# EasyEDA Pro project _Mixer NEXT GEN V3_2026-02-06.epro, schematic mixer project v3

## Sheets
1 MIC1.Preamp: Board Name: PCB3.0; Create Date: 2025-10-28; Page Name: MIC1.Preamp; Project Name: Mixer NEXT GEN V3; Schematic Name: mixer project v3; Update Date: 2025-11-09; Company: EasyEDA.com; Drawed: M.Pogue; Page Size: A4; Part Number: JLCPCB-002; Reviewed: EasyEDA Pro; Version: V2.4
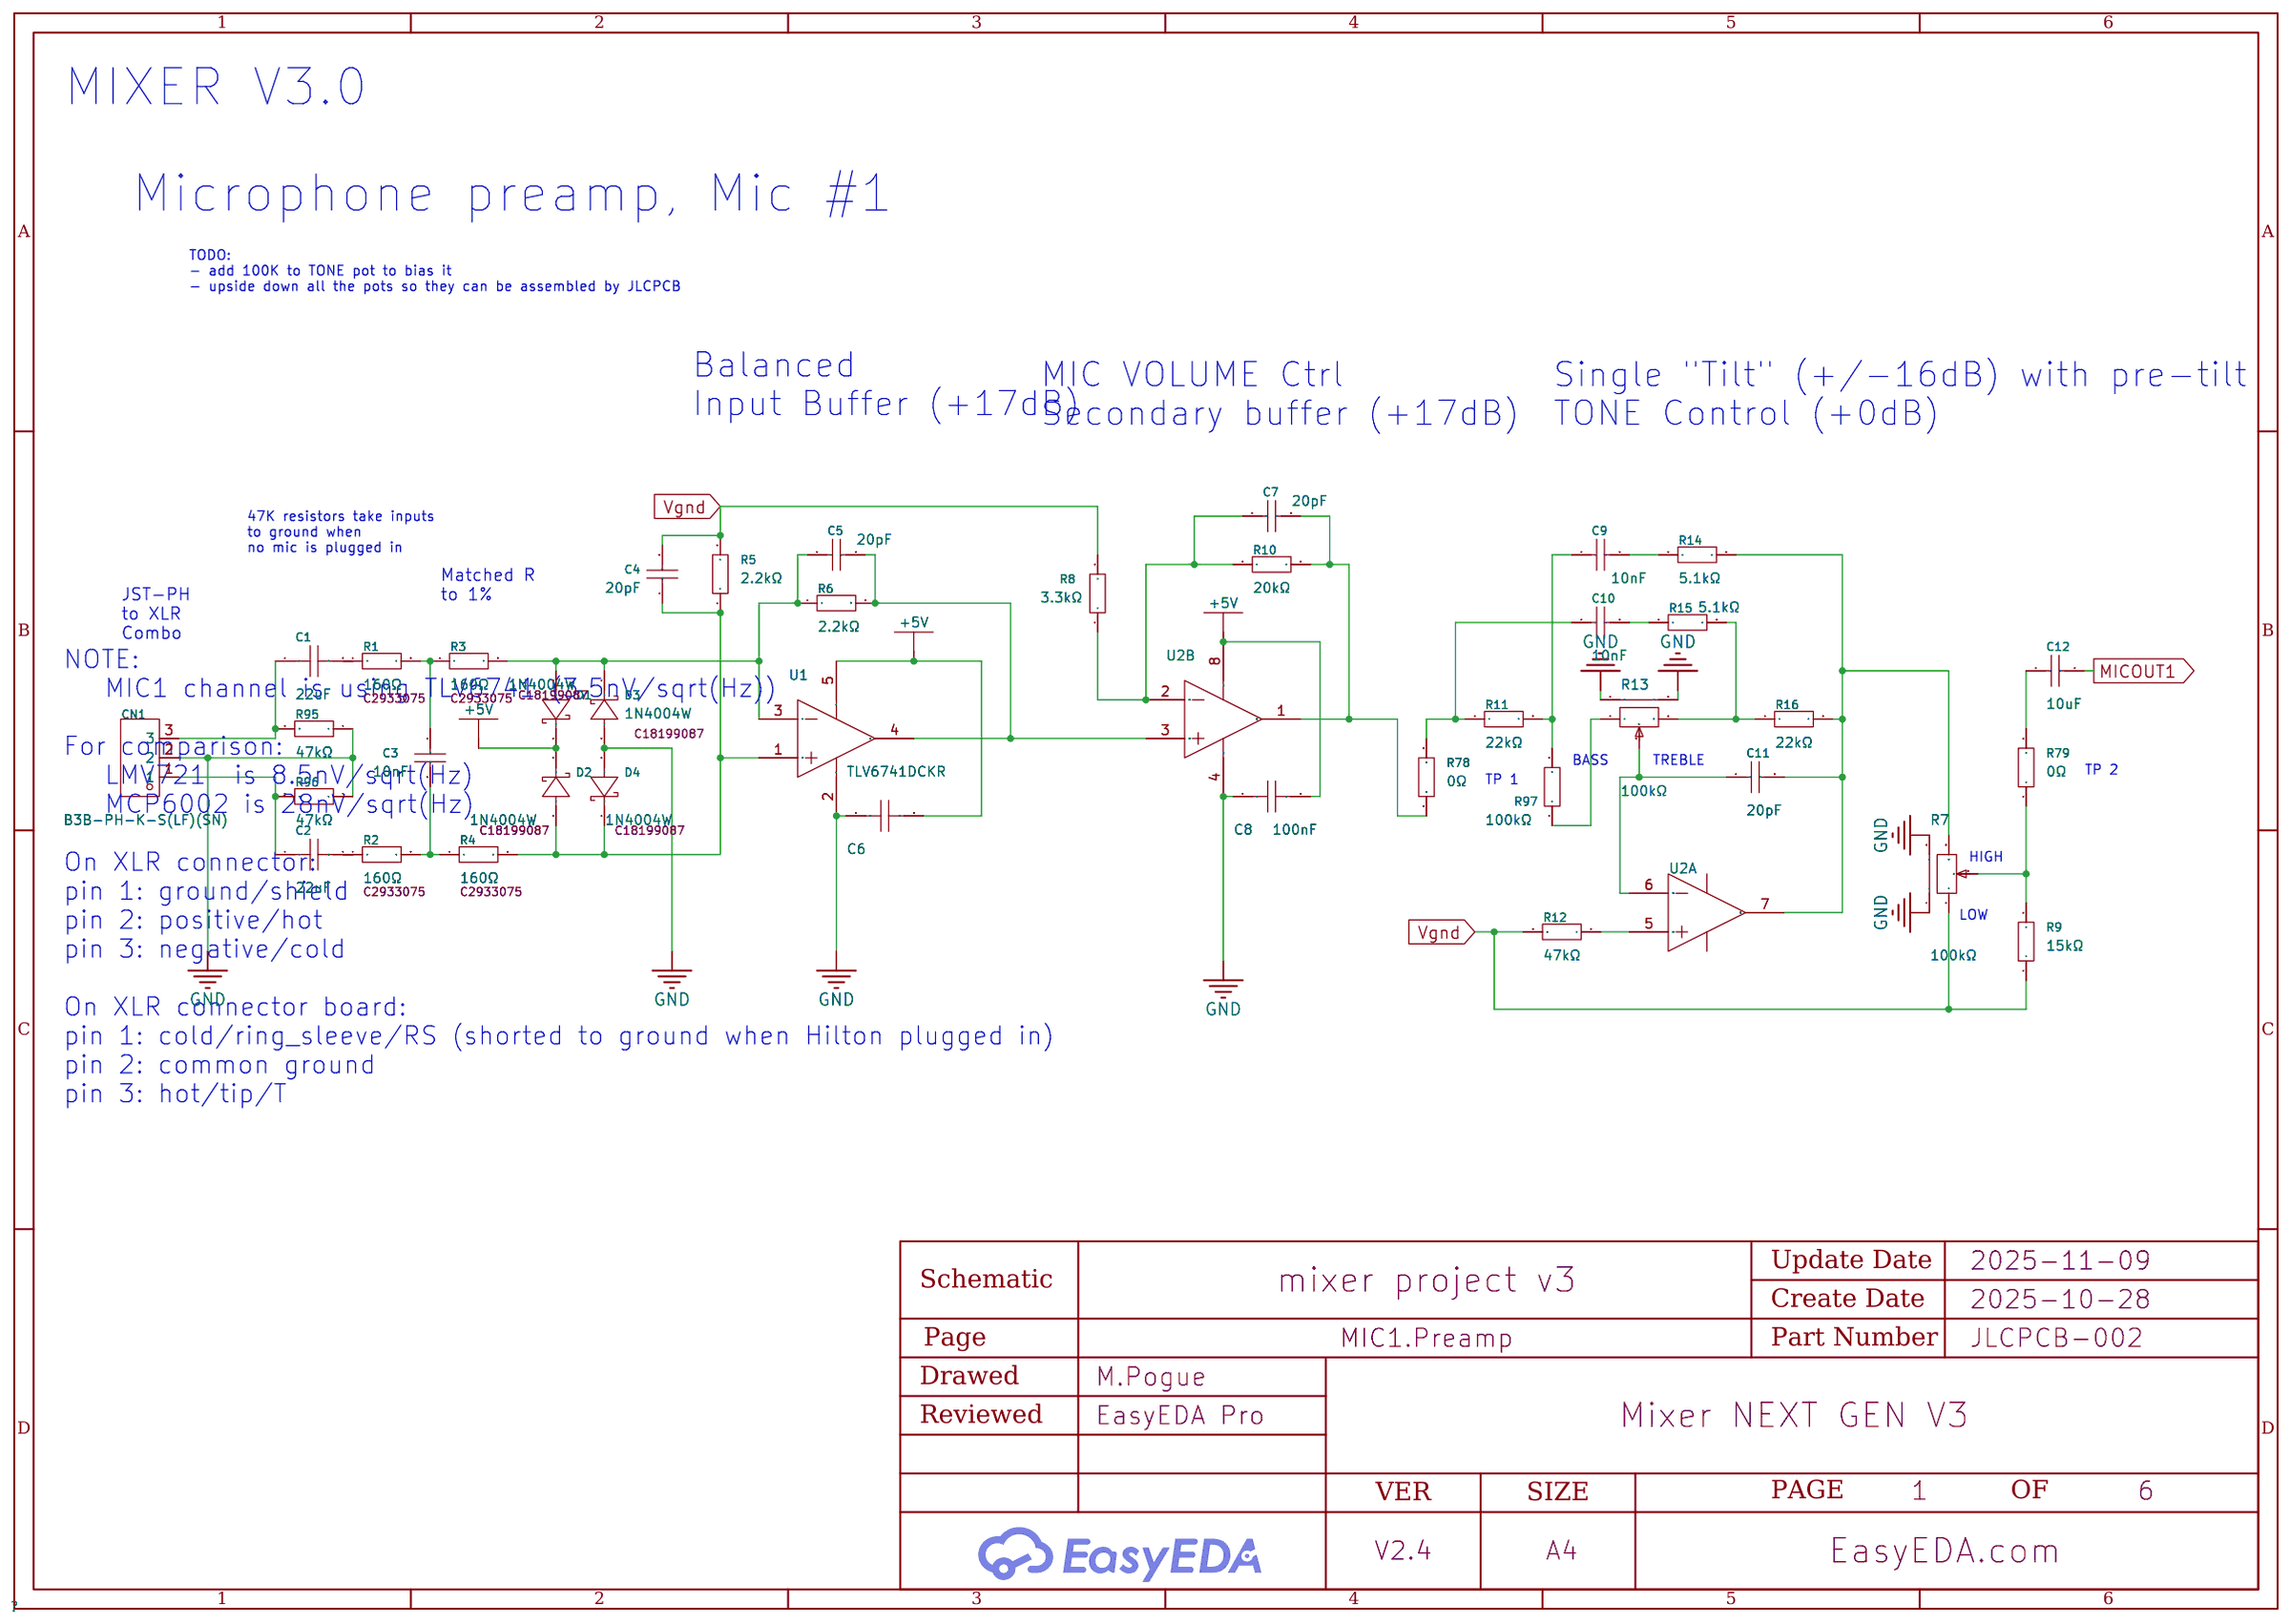
[diagram p0: MIC1.Preamp]
2 MIC2.Preamp: Page Name: MIC2.Preamp
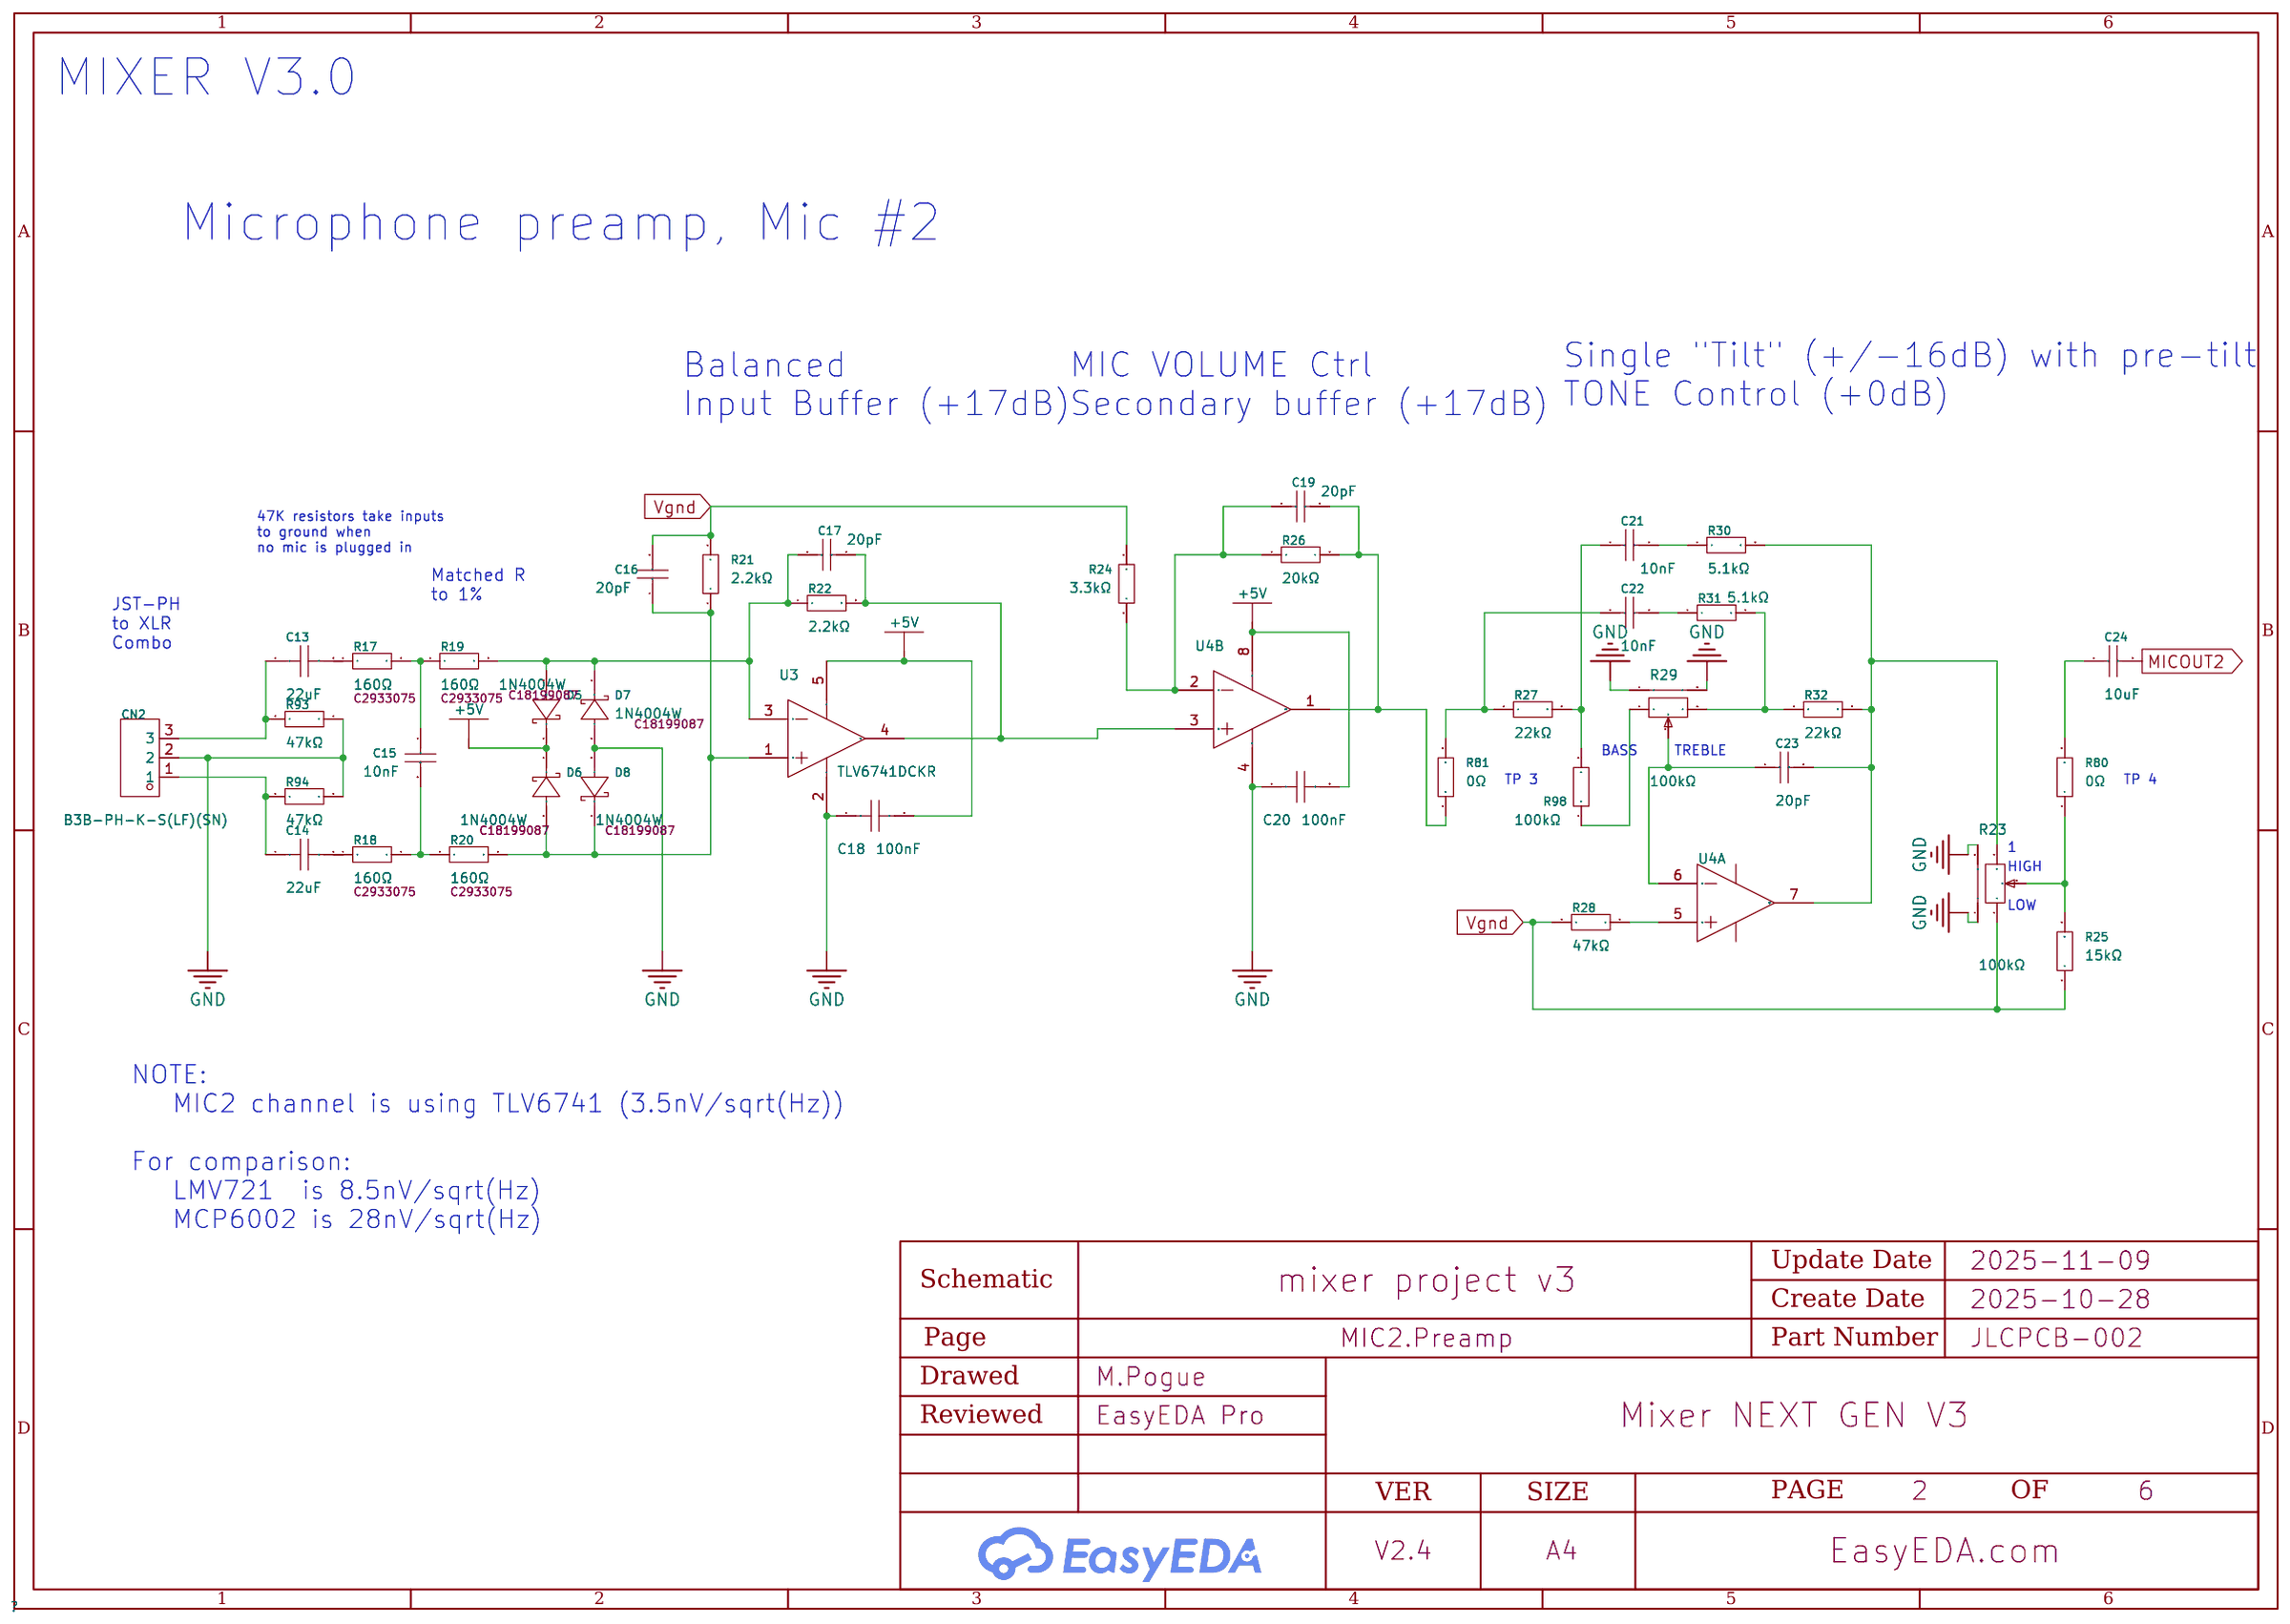
[diagram p1: MIC2.Preamp]
3 PowerSupply: Page Name: PowerSupply; Update Date: 2025-11-07
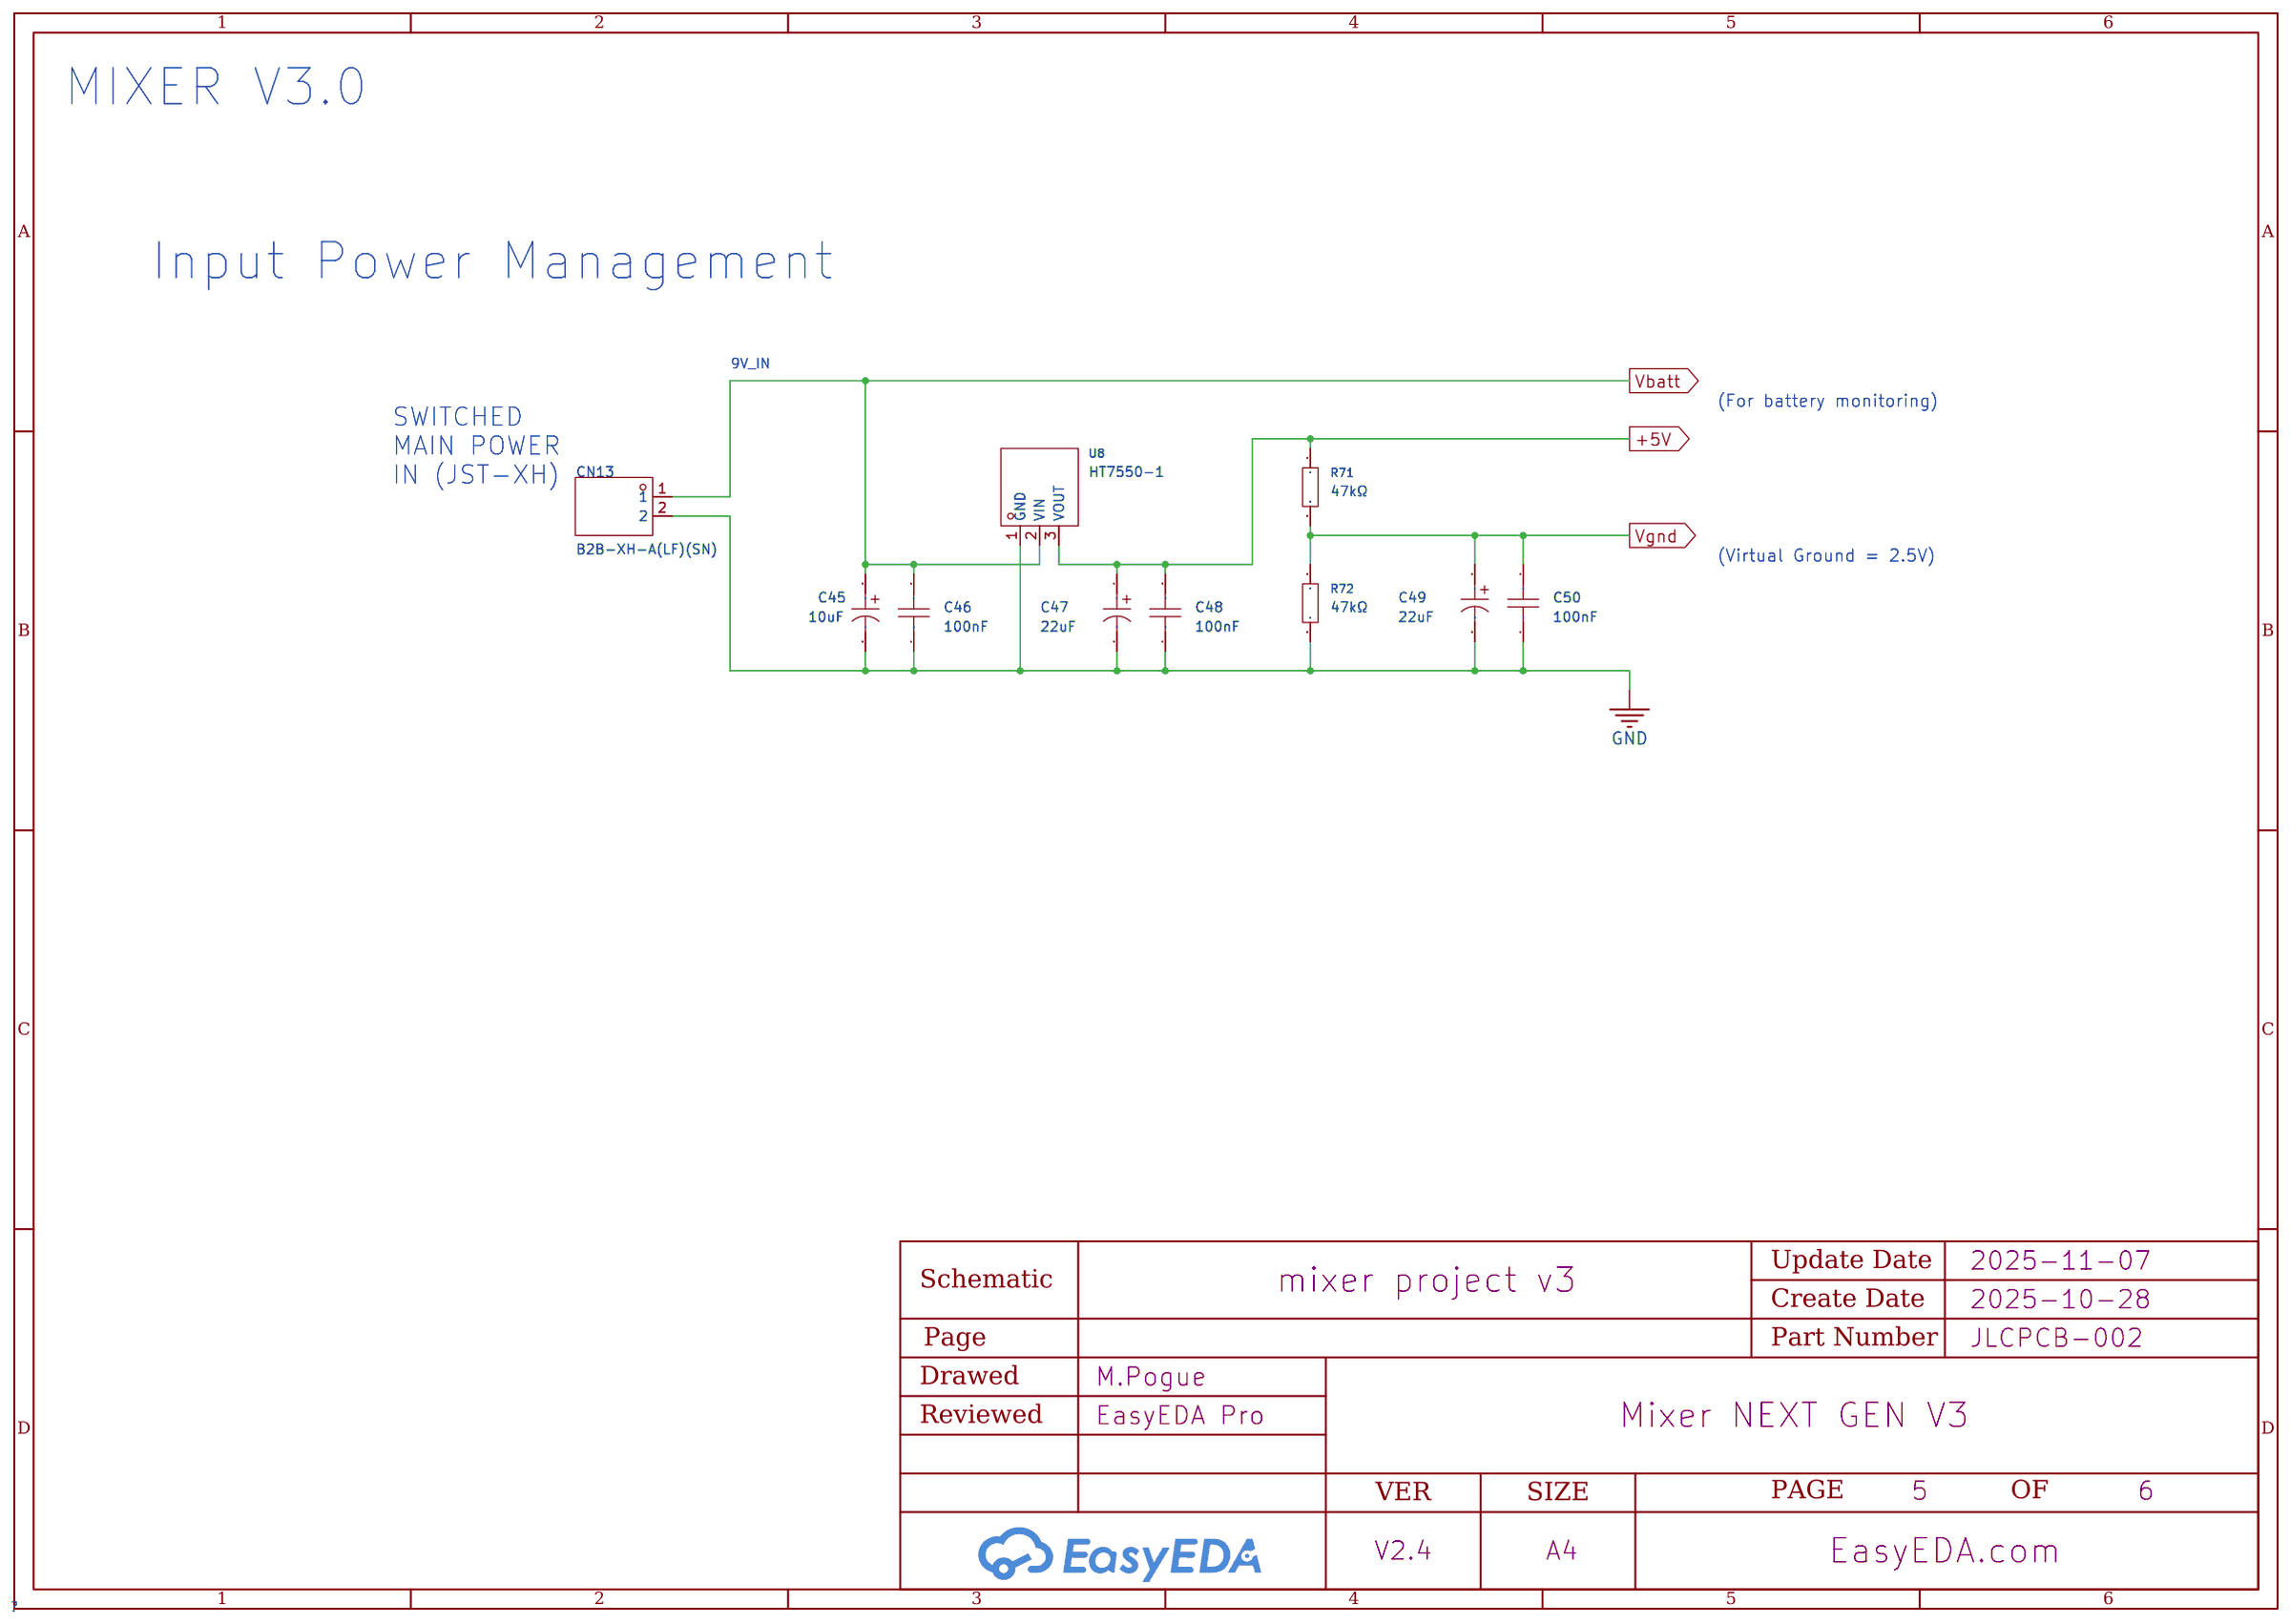
[diagram p2: PowerSupply]
4 MUSIC.Preamp: Page Name: MUSIC.Preamp; Update Date: 2025-11-20
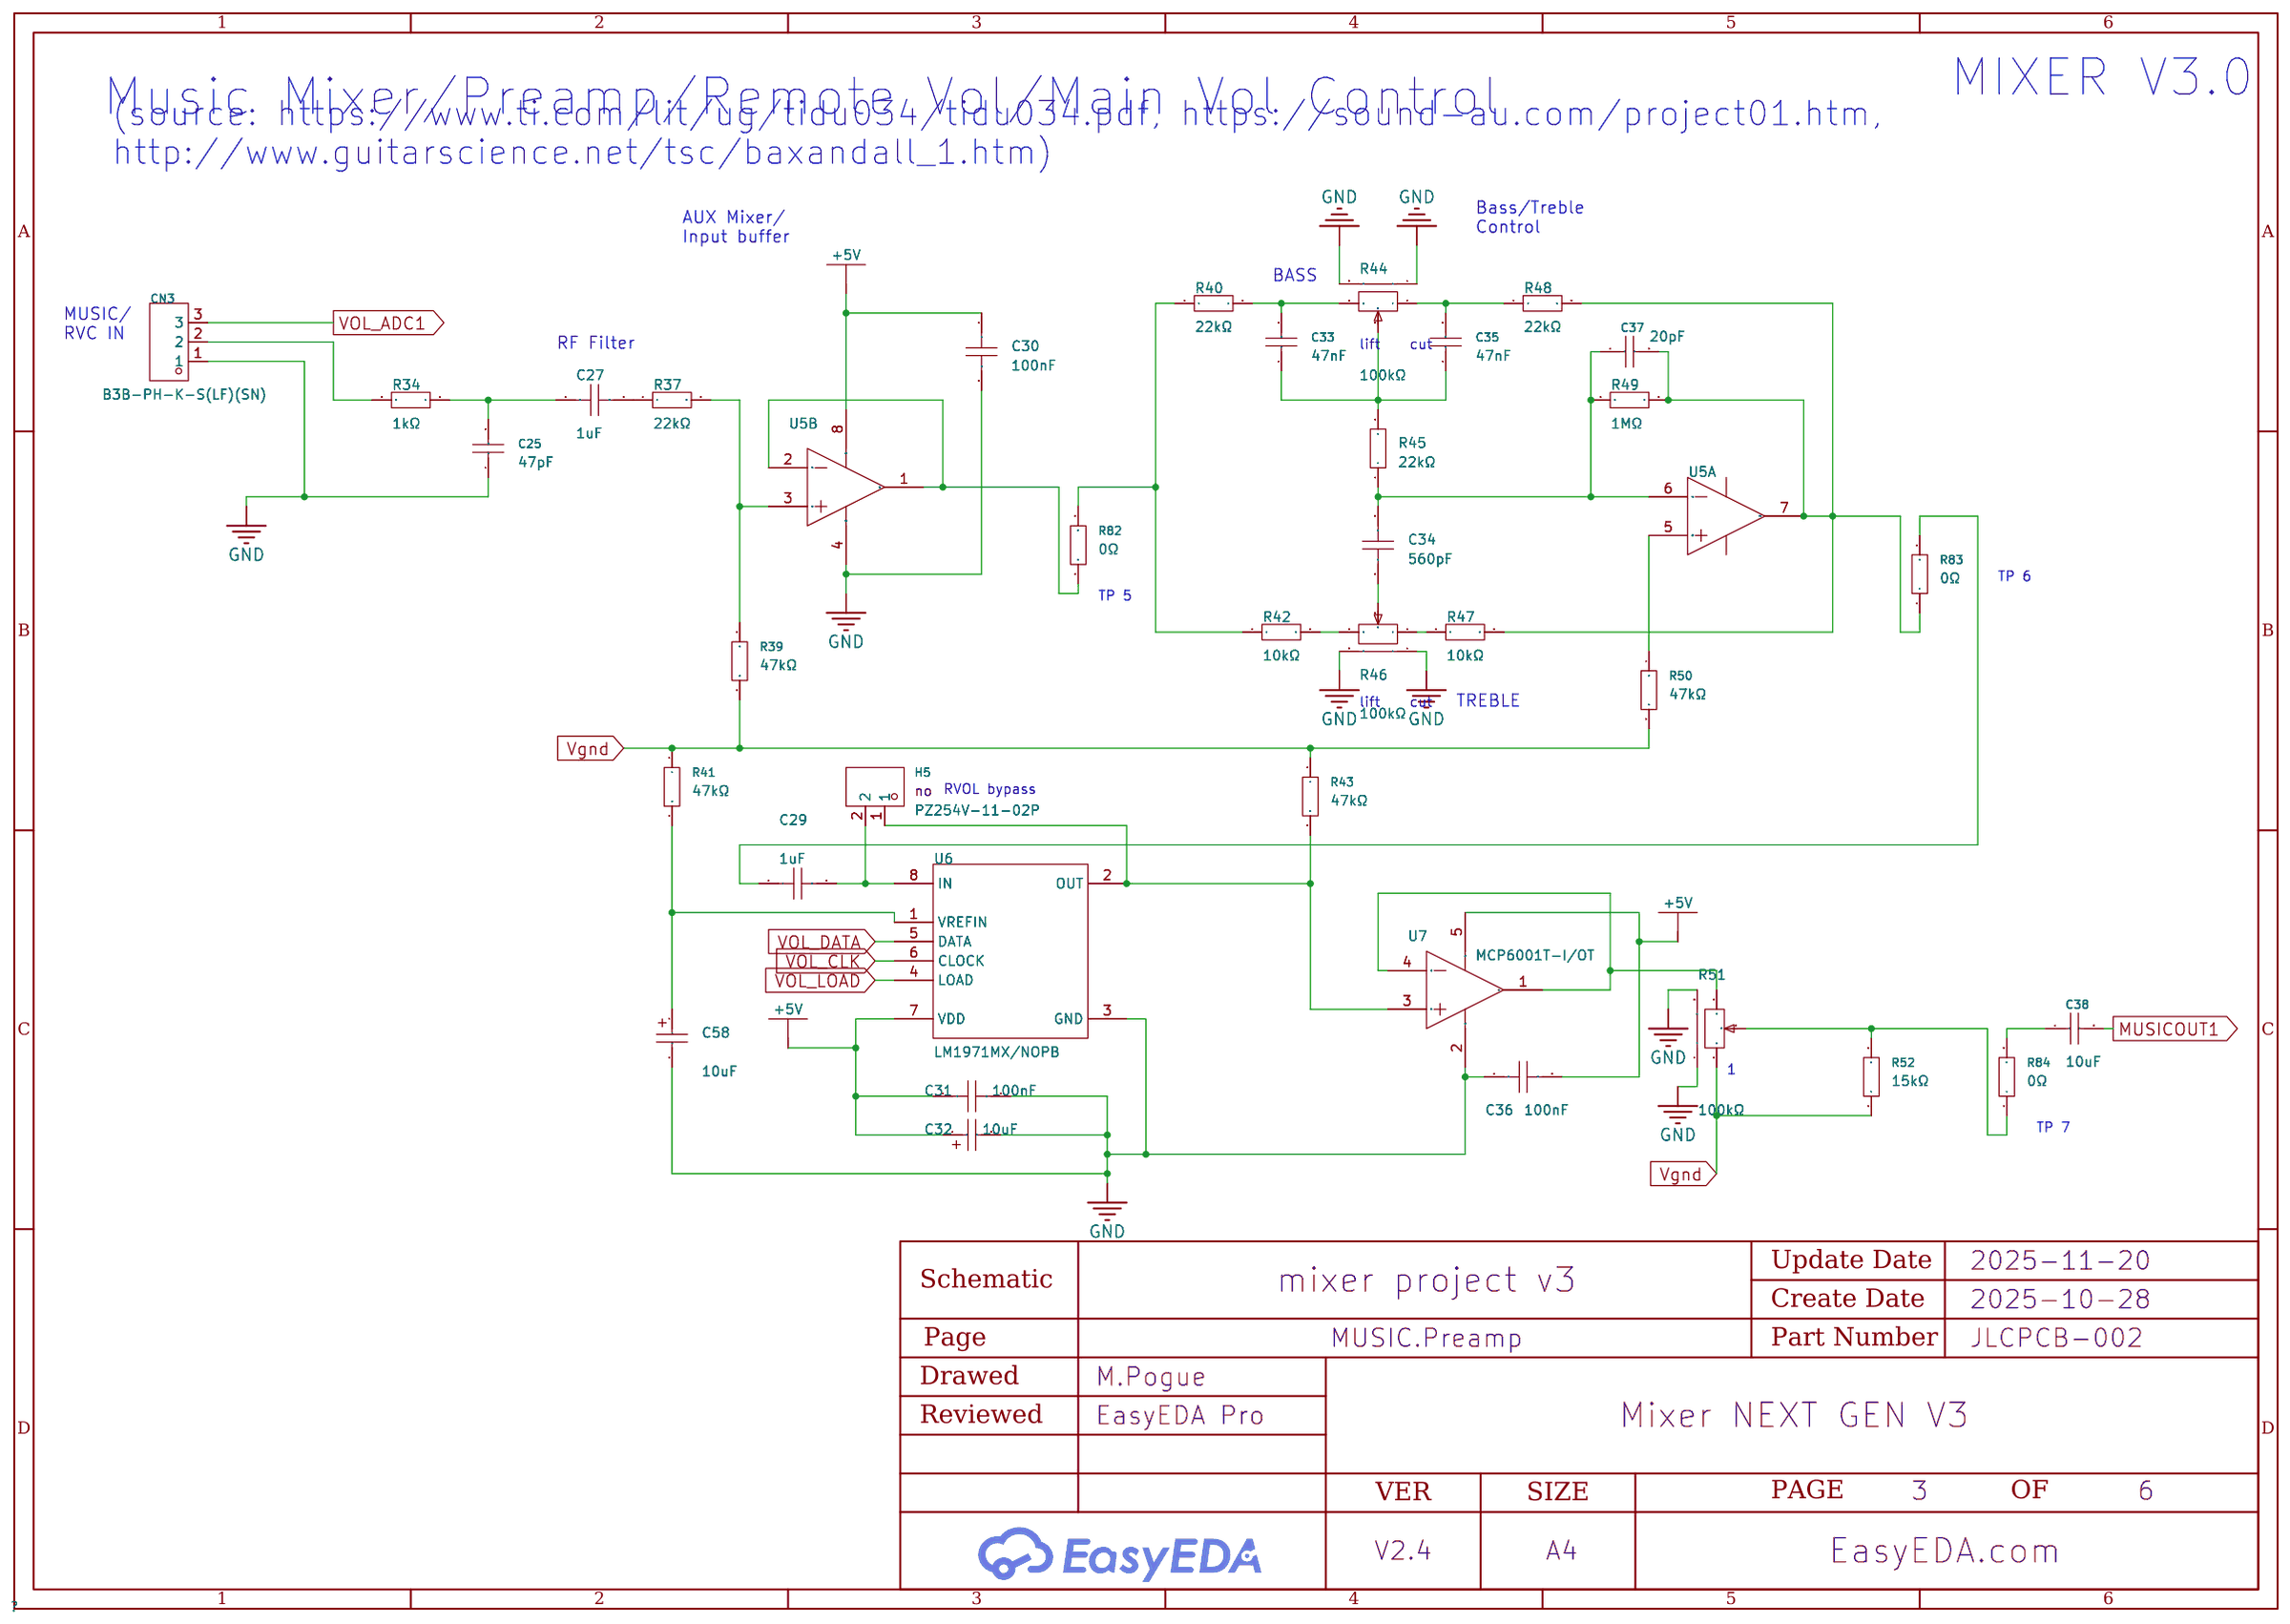
[diagram p3: MUSIC.Preamp]
5 OutputStage: Page Name: OutputStage; Update Date: 2025-10-28
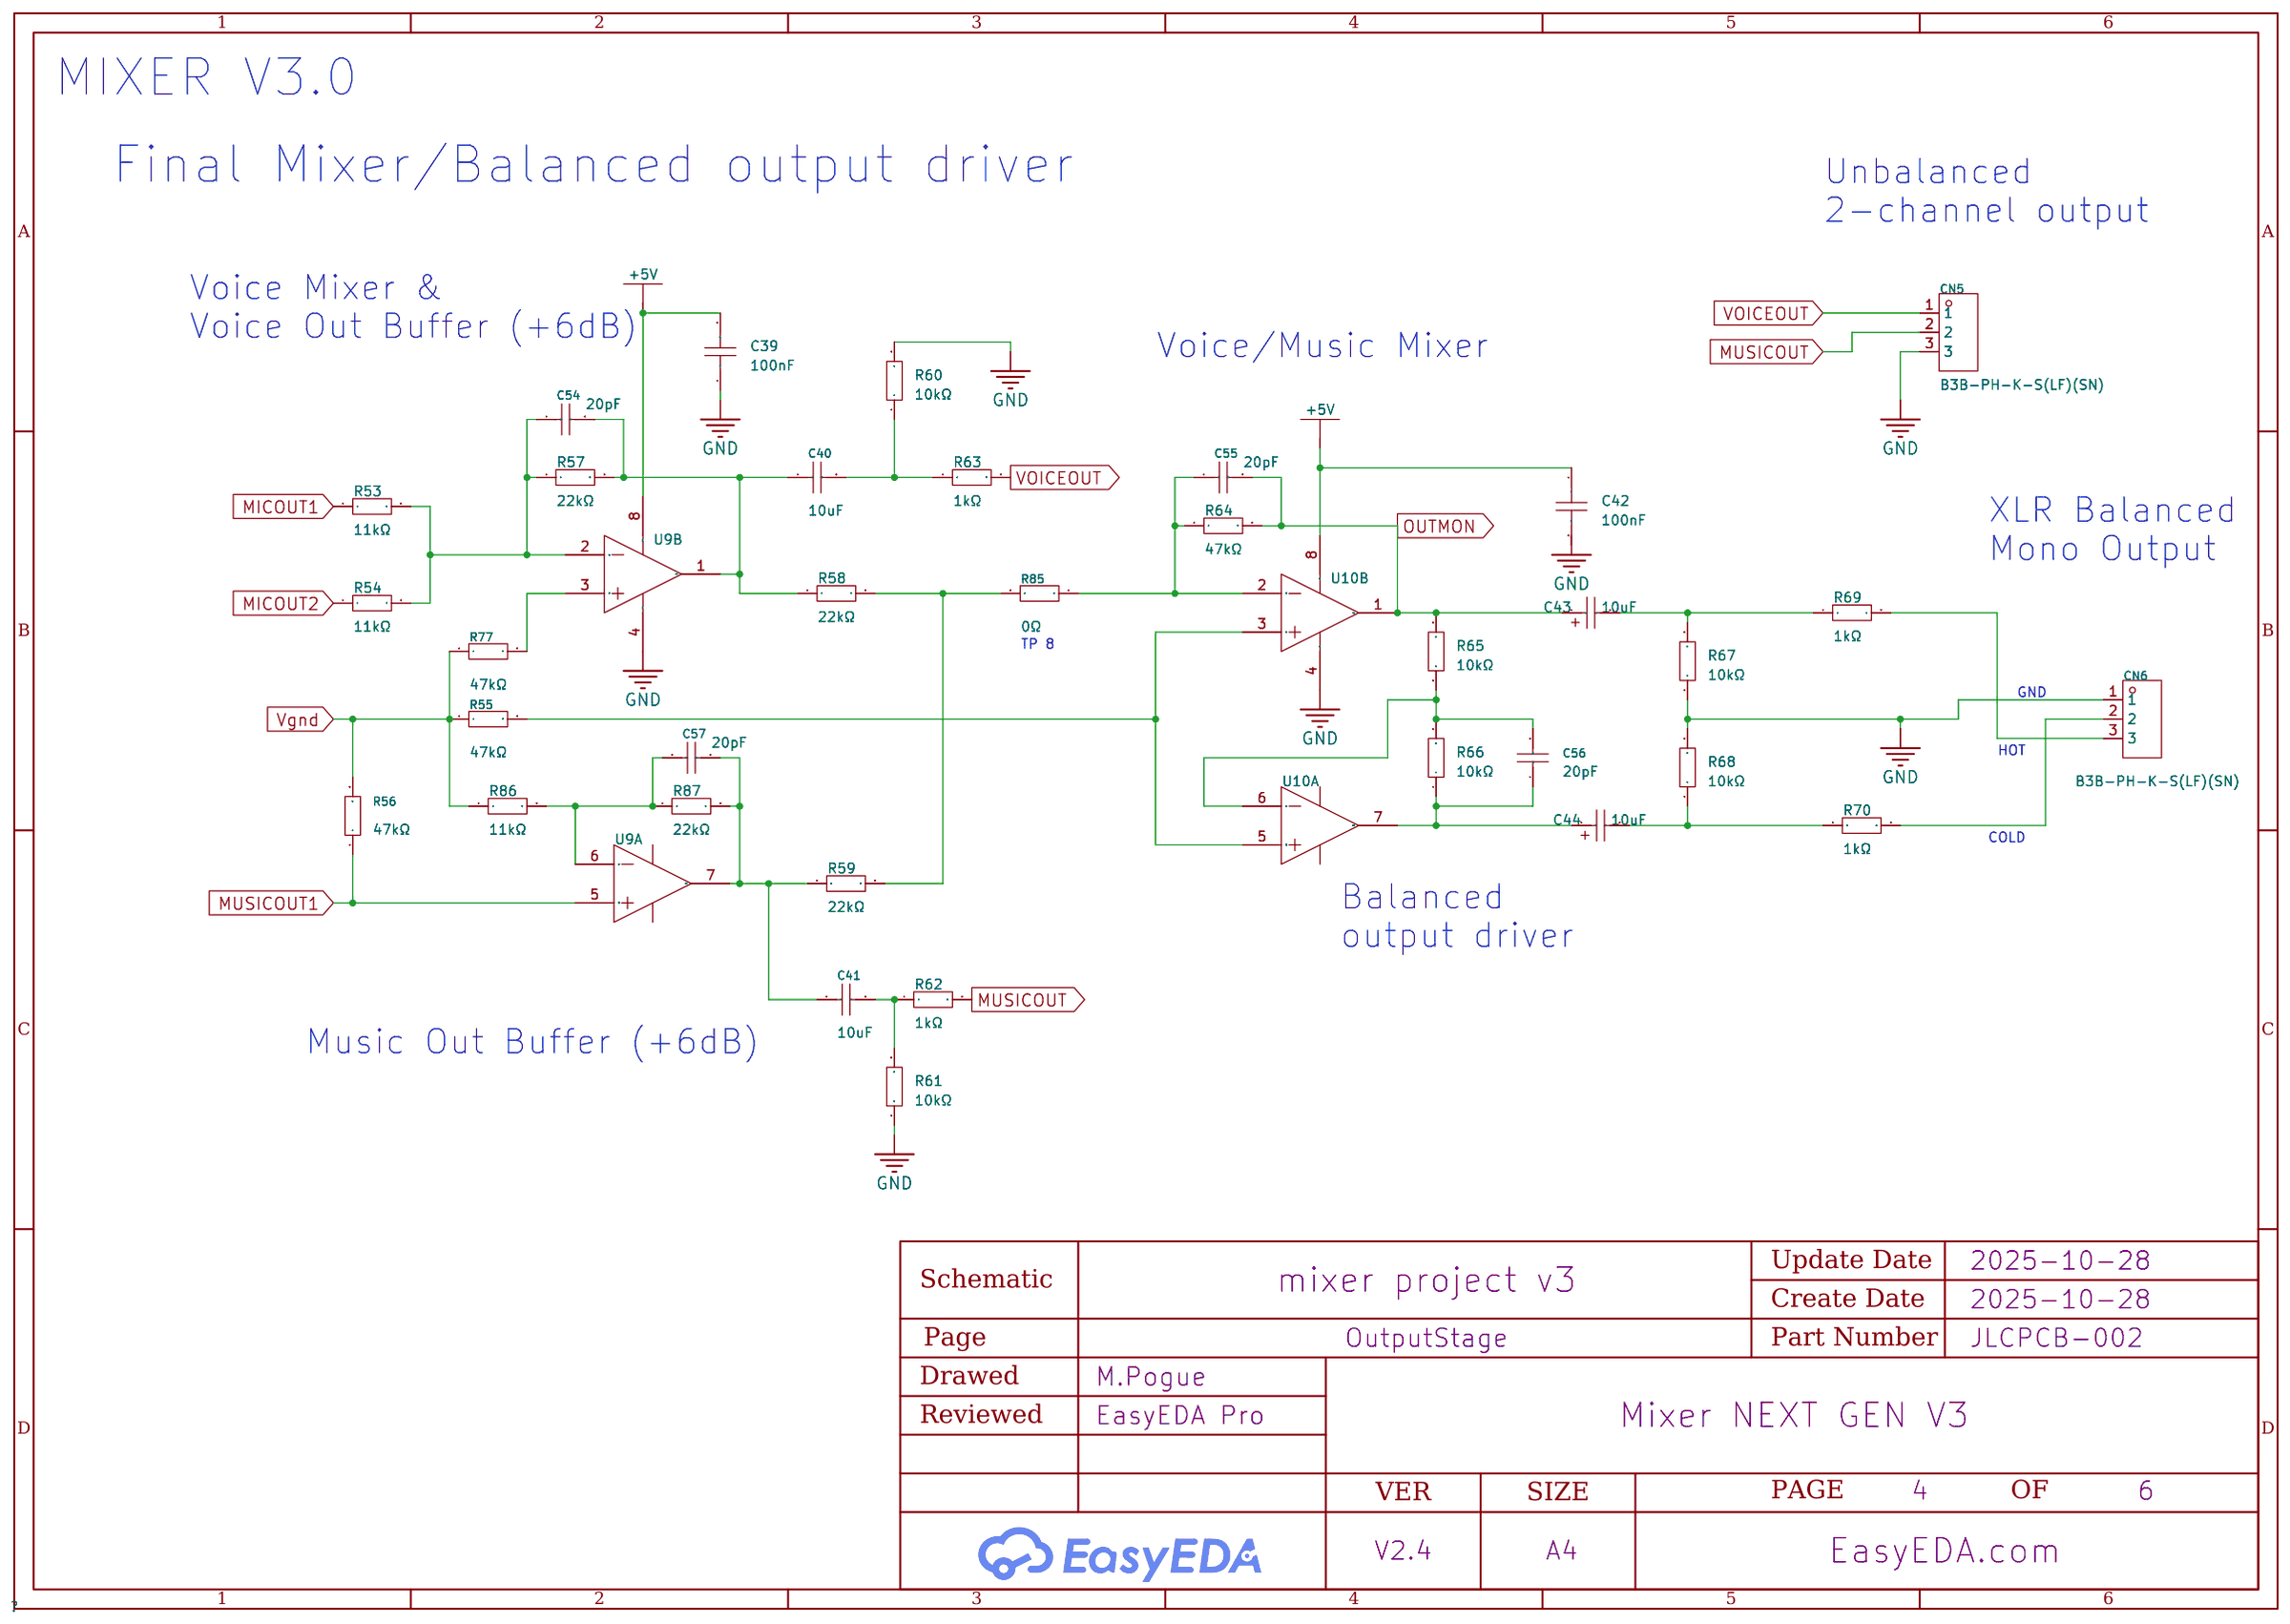
[diagram p4: OutputStage]
6 MCU: Page Name: MCU; Update Date: 2025-12-21; Company: zenstarstudio.com; Drawed: mpogue; Reviewed: mpogue; Version: V3.0.2
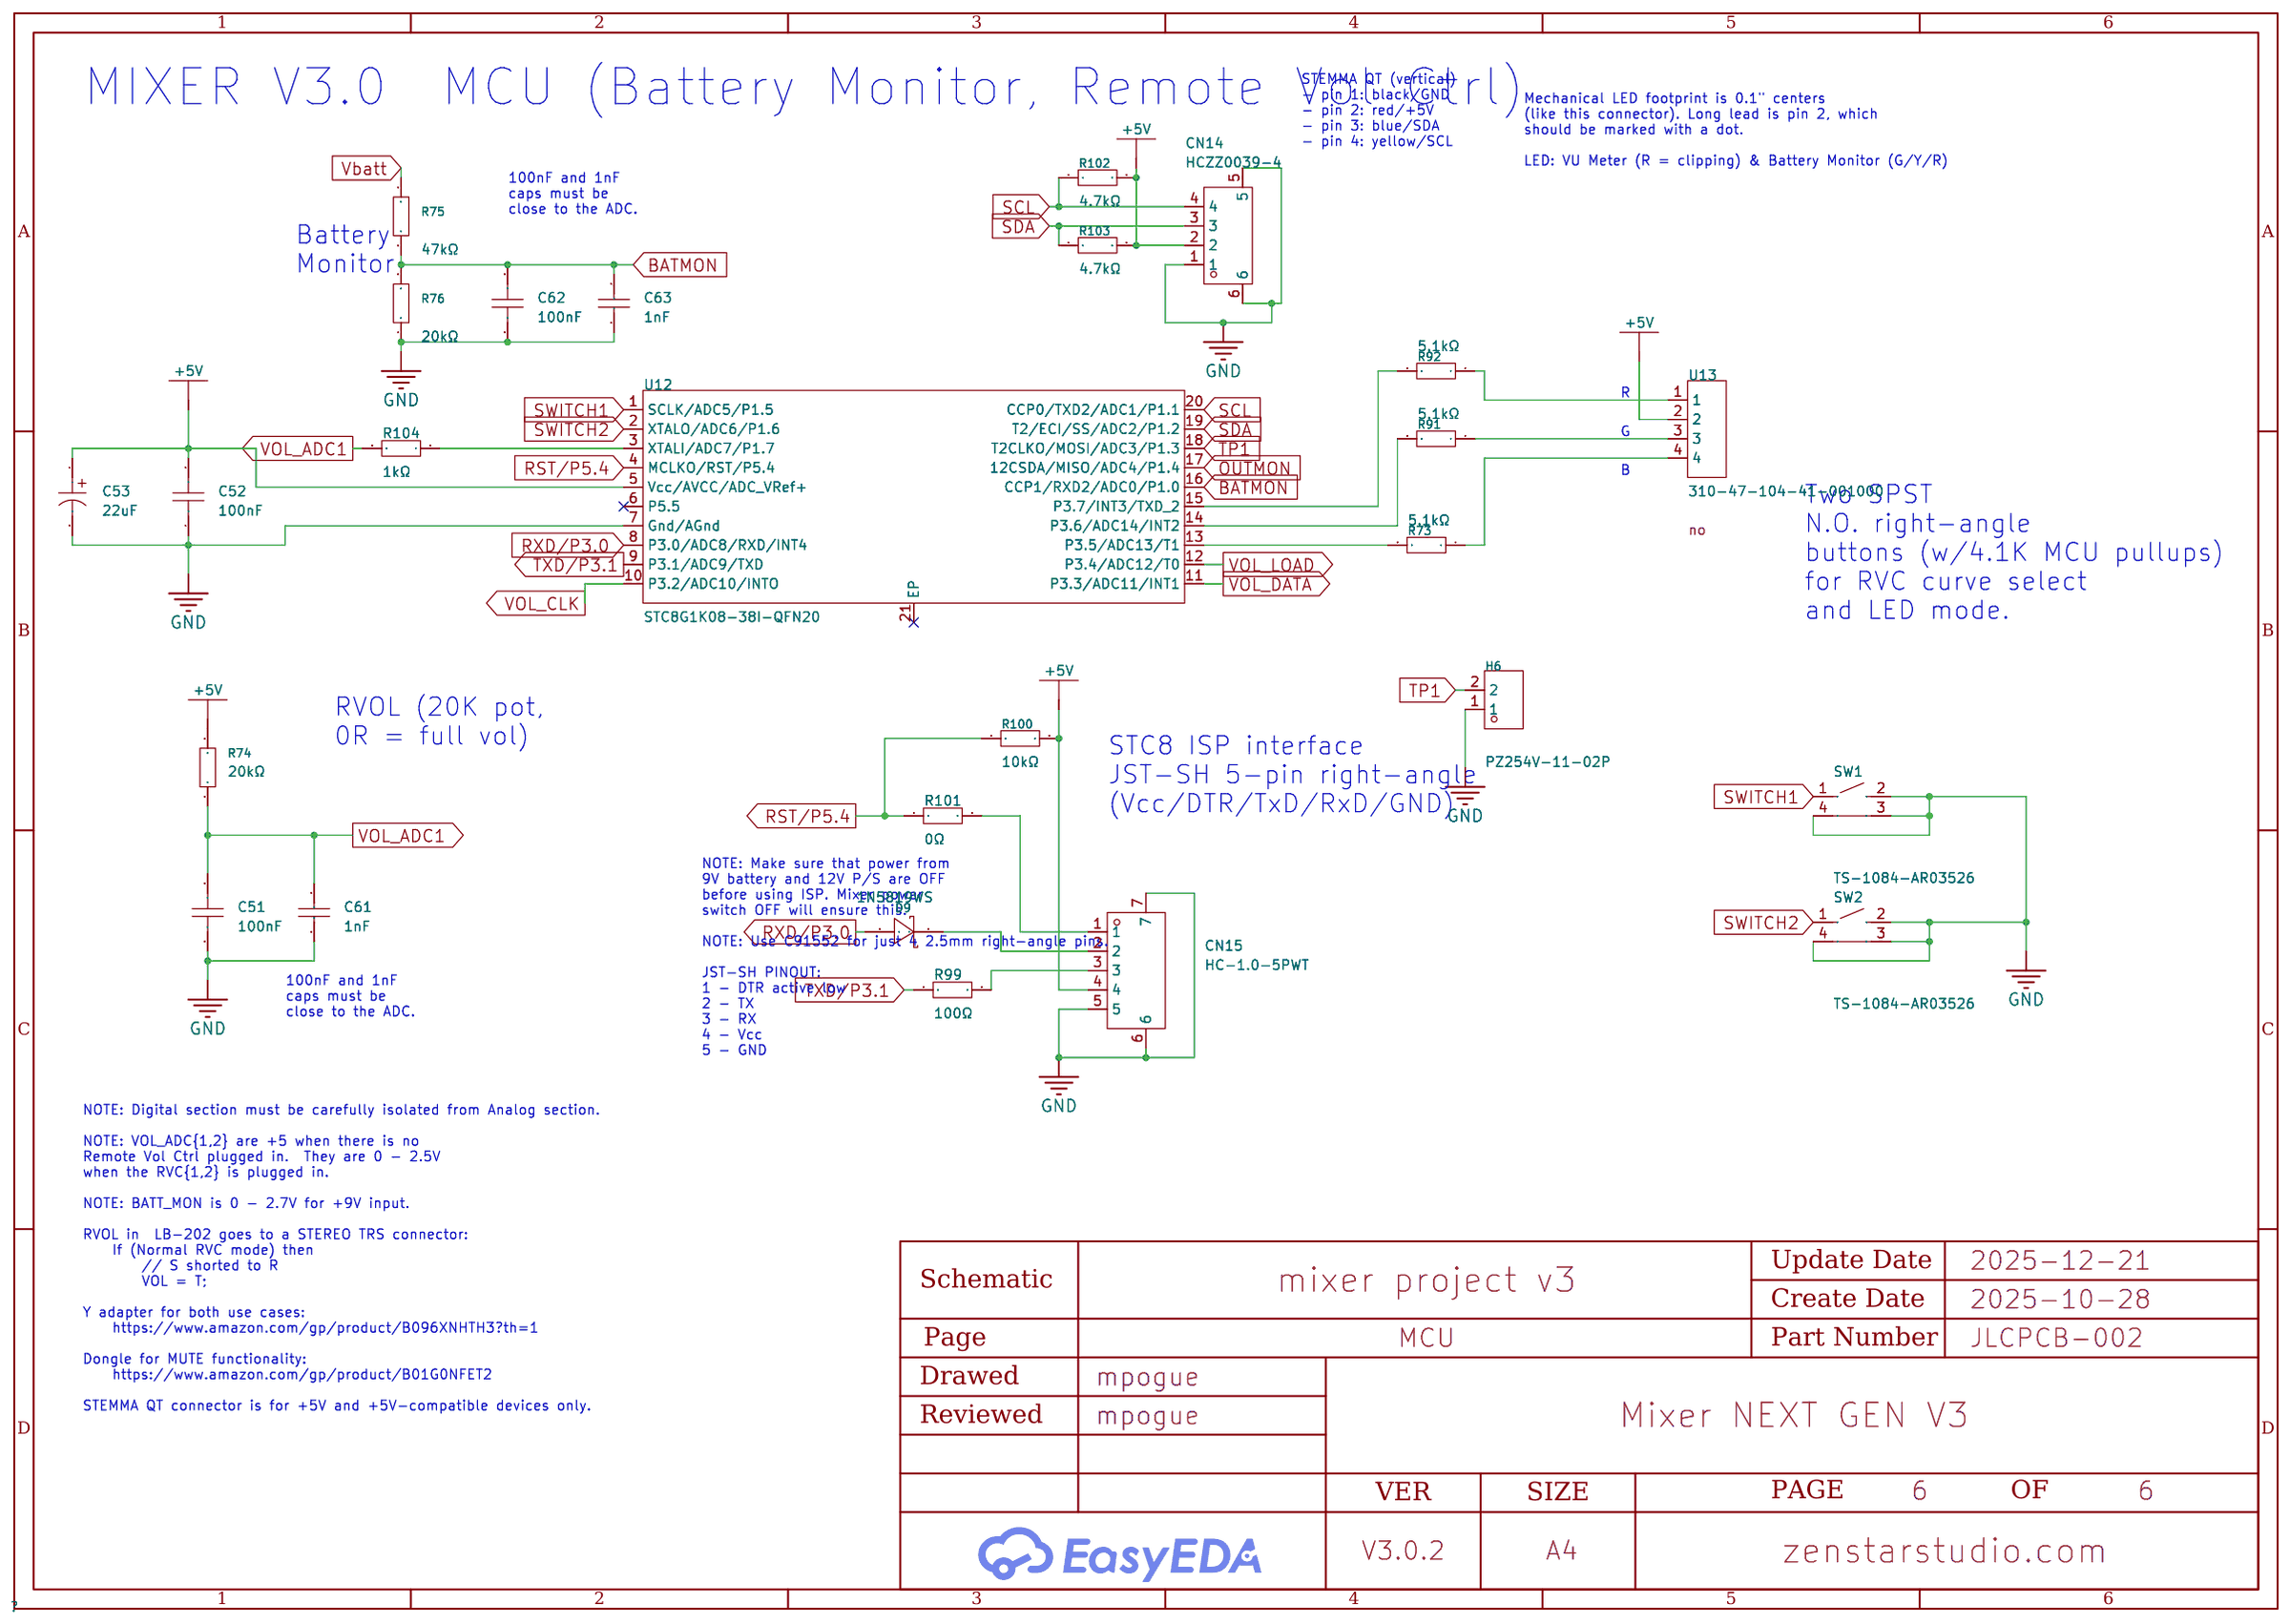
[diagram p5: MCU]

## Parts
sheet MCU
C51  100nF  [C0402]
C52  100nF  [C0402]
C53  22uF  [CAP-SMD_L3.2-W1.6]
C61  1nF  [C0402]
C62  100nF  [C0402]
C63  1nF  [C0402]
CN14  HCZZ0039-4  [CONN-SMD_HCZZ0039-4]
CN15  HC-1.0-5PWT  [CONN-SMD_5P-P1.00_HCTL_HC-1.0-5PWT]
D9  1N5819WS  [SOD-323_L1.8-W1.3-LS2.5-RD]
H6  PZ254V-11-02P  [HDR-TH_2P-P2.54-V-M]
R73  5.1kΩ  [R0402]
R74  20kΩ  [R0402]
R75  47kΩ  [R0402]
R76  20kΩ  [R0402]
R91  5.1kΩ  [R0402]
R92  5.1kΩ  [R0402]
R99  100Ω  [R0402]
R100  10kΩ  [R0402]
R101  0Ω  [R0603]
R102  4.7kΩ  [R0402]
R103  4.7kΩ  [R0402]
R104  1kΩ  [R0402]
SW1  TS-1084-AR03526  [SW-SMD_TS-1084-AR03526]
SW2  TS-1084-AR03526  [SW-SMD_TS-1084-AR03526]
U12  STC8G1K08-38I-QFN20  [TQFN-20L_L3.0-W3.0-P0.40-BL-EP]
U13  310-47-104-41-001000  [HDR-TH_4P-P2.54-V-F_316-XX-104-41-007000]  (no BOM)
sheet MIC1.Preamp
C1  22uF  [C0805]
C2  22uF  [C0805]
C3  10nF  [C0402]
C4  20pF  [C0402]
C5  20pF  [C0402]
C6  100nF  [C0402]
C7  20pF  [C0402]
C8  100nF  [C0402]
C9  10nF  [C0402]
C10  10nF  [C0402]
C11  20pF  [C0402]
C12  10uF  [C1206]
CN1  B3B-PH-K-S(LF)(SN)  [CONN-TH_B3B-PH-K-S]
D1  1N4004W  [SOD-123FL_L2.7-W1.8-LS3.8-RD]
D2  1N4004W  [SOD-123FL_L2.7-W1.8-LS3.8-RD]
D3  1N4004W  [SOD-123FL_L2.7-W1.8-LS3.8-RD]
D4  1N4004W  [SOD-123FL_L2.7-W1.8-LS3.8-RD]
R1  160Ω  [R0402]
R2  160Ω  [R0402]
R3  160Ω  [R0402]
R4  160Ω  [R0402]
R5  2.2kΩ  [R0402]
R6  2.2kΩ  [R0402]
R7  100kΩ  [RES-ADJ-TH_RK09K1130AJ3]  (no BOM)
R8  3.3kΩ  [R0402]
R9  15kΩ  [R0402]
R10  20kΩ  [R0402]
R11  22kΩ  [R0402]
R12  47kΩ  [R0402]
R13  100kΩ  [RES-ADJ-TH_RK09K1130AJ3]  (no BOM)
R14  5.1kΩ  [R0402]
R15  5.1kΩ  [R0402]
R16  22kΩ  [R0402]
R78  0Ω  [R0805]
R79  0Ω  [R0805]
R95  47kΩ  [R0402]
R96  47kΩ  [R0402]
R97  100kΩ  [R0402]
U1  TLV6741DCKR  [SC-70-5_L2.0-W1.3-P0.65-LS2.1-BR]
U2  MCP6002-I/SN  [SOIC-8_L4.9-W3.9-P1.27-LS6.0-BL]  (sections 1,2)
sheet MIC2.Preamp
C13  22uF  [C0805]
C14  22uF  [C0805]
C15  10nF  [C0402]
C16  20pF  [C0402]
C17  20pF  [C0402]
C18  100nF  [C0402]
C19  20pF  [C0402]
C20  100nF  [C0402]
C21  10nF  [C0402]
C22  10nF  [C0402]
C23  20pF  [C0402]
C24  10uF  [C1206]
CN2  B3B-PH-K-S(LF)(SN)  [CONN-TH_B3B-PH-K-S]
D5  1N4004W  [SOD-123FL_L2.7-W1.8-LS3.8-RD]
D6  1N4004W  [SOD-123FL_L2.7-W1.8-LS3.8-RD]
D7  1N4004W  [SOD-123FL_L2.7-W1.8-LS3.8-RD]
D8  1N4004W  [SOD-123FL_L2.7-W1.8-LS3.8-RD]
R17  160Ω  [R0402]
R18  160Ω  [R0402]
R19  160Ω  [R0402]
R20  160Ω  [R0402]
R21  2.2kΩ  [R0402]
R22  2.2kΩ  [R0402]
R23  100kΩ  [RES-ADJ-TH_RK09K1130AJ3]  (no BOM)
R24  3.3kΩ  [R0402]
R25  15kΩ  [R0402]
R26  20kΩ  [R0402]
R27  22kΩ  [R0402]
R28  47kΩ  [R0402]
R29  100kΩ  [RES-ADJ-TH_RK09K1130AJ3]  (no BOM)
R30  5.1kΩ  [R0402]
R31  5.1kΩ  [R0402]
R32  22kΩ  [R0402]
R80  0Ω  [R0805]
R81  0Ω  [R0805]
R93  47kΩ  [R0402]
R94  47kΩ  [R0402]
R98  100kΩ  [R0402]
U3  TLV6741DCKR  [SC-70-5_L2.0-W1.3-P0.65-LS2.1-BR]
U4  MCP6002-I/SN  [SOIC-8_L4.9-W3.9-P1.27-LS6.0-BL]  (sections 1,2)
sheet MUSIC.Preamp
C25  47pF  [C0402]
C27  1uF  [C0402]
C29  1uF  [C0402]
C30  100nF  [C0402]
C31  100nF  [C0402]
C32  10uF  [CAP-SMD_L3.2-W1.6-RD-C7171]
C33  47nF  [C0603]
C34  560pF  [C0402]
C35  47nF  [C0603]
C36  100nF  [C0402]
C37  20pF  [C0402]
C38  10uF  [C1206]
C58  10uF  [CAP-SMD_L3.2-W1.6-RD-C7171]
CN3  B3B-PH-K-S(LF)(SN)  [CONN-TH_B3B-PH-K-S]
H5  PZ254V-11-02P  [HDR-TH_2P-P2.54-V-M]  (no BOM)
R34  1kΩ  [R0402]
R37  22kΩ  [R0402]
R39  47kΩ  [R0402]
R40  22kΩ  [R0402]
R41  47kΩ  [R0402]
R42  10kΩ  [R0402]
R43  47kΩ  [R0402]
R44  100kΩ  [RES-ADJ-TH_RK09K1130AJ3]  (no BOM)
R45  22kΩ  [R0402]
R46  100kΩ  [RES-ADJ-TH_RK09K1130AJ3]  (no BOM)
R47  10kΩ  [R0402]
R48  22kΩ  [R0402]
R49  1MΩ  [R0402]
R50  47kΩ  [R0402]
R51  100kΩ  [RES-ADJ-TH_RK09K1130AJ3]  (no BOM)
R52  15kΩ  [R0402]
R82  0Ω  [R0805]
R83  0Ω  [R0805]
R84  0Ω  [R0805]
U5  MCP6002-I/SN  [SOIC-8_L4.9-W3.9-P1.27-LS6.0-BL]  (sections 1,2)
U6  LM1971MX/NOPB  [SOIC-8_L4.9-W3.9-P1.27-LS6.0-BL]
U7  MCP6001T-I/OT  [SOT-23-5_L3.0-W1.7-P0.95-LS2.8-BR]
sheet OutputStage
C39  100nF  [C0402]
C40  10uF  [C1206]
C41  10uF  [C1206]
C42  100nF  [C0402]
C43  10uF  [CAP-SMD_L3.2-W1.6-RD-C7171]
C44  10uF  [CAP-SMD_L3.2-W1.6-RD-C7171]
C54  20pF  [C0402]
C55  20pF  [C0402]
C56  20pF  [C0402]
C57  20pF  [C0402]
CN5  B3B-PH-K-S(LF)(SN)  [CONN-TH_B3B-PH-K-S]
CN6  B3B-PH-K-S(LF)(SN)  [CONN-TH_B3B-PH-K-S]
R53  11kΩ  [R0805]
R54  11kΩ  [R0805]
R55  47kΩ  [R0402]
R56  47kΩ  [R0402]
R57  22kΩ  [R0402]
R58  22kΩ  [R0402]
R59  22kΩ  [R0402]
R60  10kΩ  [R0402]
R61  10kΩ  [R0402]
R62  1kΩ  [R0402]
R63  1kΩ  [R0402]
R64  47kΩ  [R0805]
R65  10kΩ  [R0402]
R66  10kΩ  [R0402]
R67  10kΩ  [R0402]
R68  10kΩ  [R0402]
R69  1kΩ  [R0402]
R70  1kΩ  [R0402]
R77  47kΩ  [R0402]
R85  0Ω  [R0805]
R86  11kΩ  [R0805]
R87  22kΩ  [R0402]
U9  MCP6002-I/SN  [SOIC-8_L4.9-W3.9-P1.27-LS6.0-BL]  (sections 1,2)
U10  MCP6002-I/SN  [SOIC-8_L4.9-W3.9-P1.27-LS6.0-BL]  (sections 1,2)
sheet PowerSupply
C45  10uF  [CASE-B_3528]
C46  100nF  [C0402]
C47  22uF  [CAP-SMD_L3.2-W1.6]
C48  100nF  [C0402]
C49  22uF  [CAP-SMD_L3.2-W1.6]
C50  100nF  [C0402]
CN13  B2B-XH-A(LF)(SN)  [CONN-TH_B2B-XH-A-LF-SN]
R71  47kΩ  [R0402]
R72  47kΩ  [R0402]
U8  HT7550-1  [SOT-89_L4.5-W2.5-P1.50-LS4.2-BR]

## Library data of the parts
C6 C8 C18 C20 C30 C31 C36 C39 C42 C48 C50-C52 C62 = CL05B104KO5NNNC: Capacitance: Tolerance:±10% Tolerance:±10% Voltage Rated: Temperature Coefficient:; LCSC Part Name: 100nF ±10% 16V; Supplier Part: C1525; Manufacturer: SAMSUNG(三星); Supplier Footprint: 0402; JLCPCB Part Class: Basic Part; Datasheet: https://atta.szlcsc.com/upload/public/pdf/source/20160218/1457707763339.pdf; Supplier: LCSC; Tolerance: ±10%; Check: true
C47 C49 C53 = CA45-A-16V-22uF-K: Capacitance: Tolerance:±10% Tolerance:±10% Rated Voltage: Equivalent Series Resistance(ESR):6Ω@100kHz Operating Temperature:-55℃~+125℃ Operating Temperature:-55℃~+125℃; LCSC Part Name: 22uF ±10% 16V; Supplier Part: C782264; Manufacturer: CEC(振华新云); Supplier Footprint: CASE-A-3216; JLCPCB Part Class: Extended Part; Datasheet: https://atta.szlcsc.com/upload/public/pdf/source/20200909/C782264_D6D9C4EF3B25E81633C26A9294FBB820.pdf; Supplier: LCSC; Tolerance: ±10%; Equivalent Series Resistance(ESR): 6Ω@100kHz; Operating Temperature: -55℃~+125℃
C61 C63 = 0402B102K500NT: Capacitance:1nF Tolerance:±10% Tolerance:±10% Voltage Rating:50V Temperature Coefficient:X7R; LCSC Part Name: 1nF ±10% 50V; Supplier Part: C1523; Manufacturer: FH(风华); Supplier Footprint: 0402; JLCPCB Part Class: Basic Part; Datasheet: https://item.szlcsc.com/datasheet/0402B102K500NT/1875.html; Supplier: LCSC; Tolerance: ±10%; Voltage Rating: 50V; Temperature Coefficient: X7R
CN14 = HCZZ0039-4: Pins Structure:1x4P Pitch:1mm Mounting Type:Standing paste Reference Series:SH Number of Pins:4P Number of Rows:1 Number of PINs Per Row:4 Row Spacing:- Current Rating:1A Contact Material:Copper Contact Plating:Tin Operating Temperature:-25℃~+85℃ Operatin; LCSC Part Name: 米色 1x4P 间距:1mm 立贴 系列:SH; Supplier Part: C7433440; Manufacturer: HC(虹成电子); Supplier Footprint: SMD,P=1mm; JLCPCB Part Class: Extended Part; Datasheet: https://atta.szlcsc.com/upload/public/pdf/source/20250106/4055322CB7D3ABC14DCC80A80116D5CE.pdf; Supplier: LCSC; Pins Structure: 1x4P; Pitch: 1mm; Mounting Type: Standing paste; Reference Series: SH; Number of Pins: 4P; Number of Rows: 1; Number of PINs Per Row: 4; Current Rating: 1A; Contact Material: Copper; Contact Plating: Tin; Operating Temperature: -25℃~+85℃; Voltage Rating: 50V; Plastic Material: LCP; Color: Beige; X-Length of Bottom Edge on Board (Spacing Line): 6.3mm; Y-Width of Bottom Edge on Board: 3.76mm
CN15 = HC-1.0-5PWT: Pins Structure:1x5P Pitch:1mm Mounting Type:Surface Mount, Right Angle Reference Series:SH Number of Pins:5P Number of Rows:1 Number of PINs Per Row:5 Row Spacing:- Current Rating:1A Contact Material:Phosphor Bronze Contact Plating:Tin Operating Temperatu; LCSC Part Name: 1x5P 间距:1mm 卧贴 系列:SH; Supplier Part: C2845364; Manufacturer: HCTL(华灿天禄); Supplier Footprint: SMD,P=1mm,卧贴; JLCPCB Part Class: Extended Part; Datasheet: https://item.szlcsc.com/datasheet/HC-1.0-5PWT/3039045.html; Supplier: LCSC; Pins Structure: 1x5P; Pitch: 1mm; Mounting Type: Surface Mount, Right Angle; Reference Series: SH; Number of Pins: 5P; Number of Rows: 1; Number of PINs Per Row: 5; Current Rating: 1A; Contact Material: Phosphor Bronze; Contact Plating: Tin; Operating Temperature: -25℃~+85℃; Voltage Rating: 50V; Plastic Material: LCP; Flame Retardant Rating: UL94V-0; Supplementary Features: Auxiliary Solder Pin; Z-Height of the Board: 3.2mm; X-Length of Bottom Edge on Board (Spacing Line): 7.3mm; Y-Width of Bottom Edge on Board: 5.05mm
D9 = 1N5819WS_C191023: Reverse Voltage (Vr):40V Average Rectified Current (Io):1A Forward Voltage (Vf@If):600mV@1A; LCSC Part Name: 40V 1A 600mV@1A; Supplier Part: C191023; Manufacturer: Hottech(合科泰); Supplier Footprint: SOD-323; JLCPCB Part Class: Basic Part; Datasheet: https://atta.szlcsc.com/upload/public/pdf/source/20220428/3CB86FD8D28D653594B4E35F9D5AEFD9.pdf; Supplier: LCSC; Reverse Voltage (Vr): 40V; Average Rectified Current (Io): 1A; Forward Voltage (Vf@If): 600mV@1A
H5 H6 = PZ254V-11-02P: Number of Rows:Plugin Number of Pins:2P Pitch:2.54mm Pin Structure:1x2P Row Spacing:- Mounting Type:Straight Circluar Pins/Square Pins:Square Pins Current Rating (Max):- Voltage Rating (Max):- Length of Mating Pin:6mm Insulation Height:2.5mm Length of End; LCSC Part Name: 2.54mm 1x2P 直插 方针; Supplier Part: C492401; Manufacturer: XFCN(兴飞); Supplier Footprint: 插件,P=2.54mm; JLCPCB Part Class: Extended Part; Datasheet: https://atta.szlcsc.com/upload/public/pdf/source/20200309/C492401_A812433581A9B211A7FFA413ADDFF0E5.pdf; Supplier: LCSC; Number of Rows: Plugin; Number of Pins: 2P; Pitch: 2.54mm; Pin Structure: 1x2P; Mounting Type: Straight; Circluar Pins/Square Pins: Square Pins; Length of Mating Pin: 6mm; Insulation Height: 2.5mm; Length of End Connection Pin: 3mm; Operating Temperature Range: -40℃~+105℃; Color: Black
R73 R91 R92 = 0402WGF5101TCE: Type:Thick Film Resistors Resistance:5.1kΩ Tolerance:±1% Tolerance:±1% Power(Watts): Overload Voltage (Max): Temperature Coefficient:±100ppm/℃ Temperature Coefficient:±100ppm/℃ Operating Temperature Range:-55℃~+155℃ Operating Temperature Range:-55℃~+155℃; LCSC Part Name: 5.1kΩ ±1% 62.5mW 厚膜电阻; Supplier Part: C25905; Manufacturer: UNI-ROYAL(厚声); Supplier Footprint: 0402; JLCPCB Part Class: Basic Part; Datasheet: https://atta.szlcsc.com/upload/public/pdf/source/20200306/C422600_1E6D84923E4A46A82E41ADD87F860B5C.pdf; Supplier: LCSC; Tolerance: ±1%; Temperature Coefficient: ±100ppm/℃; Type: Thick Film Resistors; Operating Temperature Range: -55℃~+155℃
R10 R26 R74 R76 = 0402WGF2002TCE: Resistance:20000Ω Tolerance:±1% Tolerance:±1% Power(Watts): Overload Voltage (Max): Temperature Coefficient:±100ppm/℃ Temperature Coefficient:±100ppm/℃ Type:Thick Film Resistors Operating Temperature Range:-55℃~+155℃ Operating Temperature Range:-55℃~+155℃; LCSC Part Name: 20kΩ ±1% 62.5mW 厚膜电阻; Supplier Part: C25765; Manufacturer: UNI-ROYAL(厚声); Supplier Footprint: 0402; JLCPCB Part Class: Basic Part; Datasheet: https://atta.szlcsc.com/upload/public/pdf/source/20200306/C422600_1E6D84923E4A46A82E41ADD87F860B5C.pdf; Supplier: LCSC; Tolerance: ±1%; Temperature Coefficient: ±100ppm/℃; Type: Thick Film Resistors; Operating Temperature Range: -55℃~+155℃
R12 R28 R39 R41 R43 R50 R55 R56 R71 R72 R75 R77 R93-R96 = 0402WGF4702TCE: Type:Thick Film Resistors Resistance: Tolerance:±1% Tolerance:±1% Power(Watts): Temperature Coefficient:±100ppm/℃ Temperature Coefficient:±100ppm/℃ Overload Voltage (Max): Operating Temperature Range:-55℃~+155℃ Operating Temperature Range:-55℃~+155℃; LCSC Part Name: 厚膜电阻 47kΩ ±1% 62.5mW; Supplier Part: C25792; Manufacturer: UNI-ROYAL(厚声); Supplier Footprint: 0402; JLCPCB Part Class: Basic Part; Datasheet: https://atta.szlcsc.com/upload/public/pdf/source/20200306/C422600_1E6D84923E4A46A82E41ADD87F860B5C.pdf; Supplier: LCSC; Type: Thick Film Resistors; Tolerance: ±1%; Temperature Coefficient: ±100ppm/℃; Operating Temperature Range: -55℃~+155℃
R99 = 0402WGF1000TCE: Type:Thick Film Resistors Resistance: Tolerance:±1% Tolerance:±1% Power(Watts): Overload Voltage (Max): Temperature Coefficient:±200ppm/℃ Temperature Coefficient:±200ppm/℃ Operating Temperature Range:-55℃~+155℃ Operating Temperature Range:-55℃~+155℃; LCSC Part Name: 100Ω ±1% 62.5mW 厚膜电阻; Supplier Part: C25076; Manufacturer: UNI-ROYAL(厚声); Supplier Footprint: 0402; JLCPCB Part Class: Basic Part; Datasheet: https://atta.szlcsc.com/upload/public/pdf/source/20200306/C422600_1E6D84923E4A46A82E41ADD87F860B5C.pdf; Supplier: LCSC; Type: Thick Film Resistors; Tolerance: ±1%; Temperature Coefficient: ±200ppm/℃; Operating Temperature Range: -55℃~+155℃
R100 = 0402WGF1002TCE: Type:Thick Film Resistors Resistance: Tolerance:±1% Tolerance:±1% Power(Watts): Temperature Coefficient:±100ppm/℃ Temperature Coefficient:±100ppm/℃ Overload Voltage (Max): Operating Temperature Range:-55℃~+155℃ Operating Temperature Range:-55℃~+155℃; LCSC Part Name: 厚膜电阻 10kΩ ±1% 62.5mW; Supplier Part: C25744; Manufacturer: UNI-ROYAL(厚声); Supplier Footprint: 0402; JLCPCB Part Class: Basic Part; Datasheet: https://atta.szlcsc.com/upload/public/pdf/source/20200306/C422600_1E6D84923E4A46A82E41ADD87F860B5C.pdf; Supplier: LCSC; Type: Thick Film Resistors; Tolerance: ±1%; Temperature Coefficient: ±100ppm/℃; Operating Temperature Range: -55℃~+155℃
R101 = 0603WAF0000T5E: Type:Thick Film Resistor Resistance:0Ω Tolerance:±1% Tolerance:±1% Power(Watts):100mW Voltage-Supply(Max):75V Temperature Coefficient:- Temperature Coefficient:- Operating Temperature:-55℃~+155℃ Operating Temperature:-55℃~+155℃; LCSC Part Name: 0Ω ±1% 100mW 厚膜电阻; Supplier Part: C21189; Manufacturer: UNI-ROYAL(厚声); Supplier Footprint: 0603; JLCPCB Part Class: Basic Part; Datasheet: https://item.szlcsc.com/datasheet/0603WAF0000T5E/21903.html; Supplier: LCSC; Type: Thick Film Resistor; Tolerance: ±1%; Power(Watts): 100mW; Voltage-Supply(Max): 75V; Operating Temperature: -55℃~+155℃
R102 R103 = 0402WGF4701TCE: Type:Thick Film Resistor Resistance:4.7kΩ Tolerance:±1% Tolerance:±1% Power(Watts):62.5mW Voltage-Supply(Max):50V Temperature Coefficient:±100ppm/℃ Temperature Coefficient:±100ppm/℃ Operating Temperature:-55℃~+155℃ Operating Temperature:-55℃~+155℃; LCSC Part Name: 4.7kΩ ±1% 62.5mW 厚膜电阻; Supplier Part: C25900; Manufacturer: UNI-ROYAL(厚声); Supplier Footprint: 0402; JLCPCB Part Class: Basic Part; Datasheet: https://item.szlcsc.com/datasheet/0402WGF4701TCE/26643.html; Supplier: LCSC; Type: Thick Film Resistor; Tolerance: ±1%; Power(Watts): 62.5mW; Voltage-Supply(Max): 50V; Temperature Coefficient: ±100ppm/℃; Operating Temperature: -55℃~+155℃
R34 R62 R63 R69 R70 R104 = 0402WGF1001TCE: Type:Thick Film Resistors Resistance: Tolerance:±1% Tolerance:±1% Power(Watts): Temperature Coefficient:±100ppm/℃ Temperature Coefficient:±100ppm/℃ Overload Voltage (Max): Operating Temperature Range:-55℃~+155℃ Operating Temperature Range:-55℃~+155℃; LCSC Part Name: 1kΩ ±1% 62.5mW; Supplier Part: C11702; Manufacturer: UNI-ROYAL(厚声); Supplier Footprint: 0402; JLCPCB Part Class: Basic Part; Datasheet: https://atta.szlcsc.com/upload/public/pdf/source/20200306/C422600_1E6D84923E4A46A82E41ADD87F860B5C.pdf; Supplier: LCSC; Type: Thick Film Resistors; Tolerance: ±1%; Temperature Coefficient: ±100ppm/℃; Operating Temperature Range: -55℃~+155℃; Check: true
SW1 SW2 = TS-1084-AR03526: Circuit:SPST Actuator Style:Round Button Operating Force:2.6N Mounting Type:Surface Mount, Right Angle Length:4.5mm Width:3.4mm Switch Height:3.5mm with Bracket:With Bracket Contact Current:50mA Voltage Rating:12V Actuator/Cap Color:White Termination Styl; LCSC Part Name: 4.5*3.4*3.5mm 卧贴 轻触开关; Supplier Part: C720495; Manufacturer: XUNPU(讯普); Supplier Footprint: SMD,4.5x3.4mm; JLCPCB Part Class: Extended Part; Datasheet: https://item.szlcsc.com/datasheet/TS-1084-AR03526/763502.html; Supplier: LCSC; Circuit: SPST; Actuator Style: Round Button; Operating Force: 2.6N; Mounting Type: Surface Mount, Right Angle; Length: 4.5mm; Width: 3.4mm; Switch Height: 3.5mm; with Bracket: With Bracket; Contact Current: 50mA; Voltage Rating: 12V; Actuator/Cap Color: White; Termination Style: SMD(SMT) Tab; Life: 100,000 Cycles; Operating Temperature: -30℃~+80℃
U12 = STC8G1K08-38I-QFN20: CPU Core:51Series Program Storage Size:8KB Program Memory Type:FLASH ADC (Bit):10bit Applications:-; Supplier Part: C521758; Manufacturer: STC; Supplier Footprint: TQFN-20L-EP(3x3); JLCPCB Part Class: Extended Part; Datasheet: https://atta.szlcsc.com/upload/public/pdf/source/20250217/7BDD584DB3F27344196CFFD3FF483545.pdf; Supplier: LCSC; CPU Core: 51Series; Program Storage Size: 8KB; Program Memory Type: FLASH; ADC (Bit): 10bit
U13 = 310-47-104-41-001000: Pitch:2.54mm Mounting Type:Through Hole Number of Rows:1 Number of Positions:4P Current Rating:3A Voltage Rating (Max):- Insulation Height:2.79mm Contact Plating:Tin Operating Temperature:-55℃~+125℃ Operating Temperature:-55℃~+125℃; LCSC Part Name: 间距:2.54mm 直插; Supplier Part: C6055489; Manufacturer: Mill-Max Mfg. Corp.; Supplier Footprint: 插件,P=2.54mm; JLCPCB Part Class: Extended Part; Datasheet: https://item.szlcsc.com/datasheet/310-47-104-41-001000/6994624.html; Supplier: LCSC; Pitch: 2.54mm; Mounting Type: Through Hole; Number of Rows: 1; Number of Positions: 4P; Current Rating: 3A; Insulation Height: 2.79mm; Contact Plating: Tin; Operating Temperature: -55℃~+125℃
C1 C2 C13 C14 = CL21A226MAQNNNE_C45783: Capacitance: Tolerance:±20% Tolerance:±20% Voltage Rated: Temperature Coefficient:; LCSC Part Name: 22uF ±20% 25V; Supplier Part: C45783; Manufacturer: SAMSUNG(三星); Manufacturer Part: CL21A226MAQNNNE; Supplier Footprint: 0805; JLCPCB Part Class: Basic Part; Datasheet: https://atta.szlcsc.com/upload/public/pdf/source/20160218/1457707763339.pdf; Supplier: LCSC; Tolerance: ±20%
C3 C9 C10 C15 C21 C22 = CL05B103KB5NNNC: Capacitance: Tolerance:±10% Tolerance:±10% Voltage Rated: Temperature Coefficient:; LCSC Part Name: 10nF ±10% 50V; Supplier Part: C15195; Manufacturer: SAMSUNG(三星); Supplier Footprint: 0402; JLCPCB Part Class: Basic Part; Datasheet: https://atta.szlcsc.com/upload/public/pdf/source/20160218/1457707763339.pdf; Supplier: LCSC; Tolerance: ±10%
C4 C5 C7 C11 C16 C17 C19 C23 C37 C54-C57 = 0402CG200J500NT: Capacitance: Tolerance:±5% Tolerance:±5% Voltage Rated: Temperature Coefficient:; LCSC Part Name: 20pF ±5% 50V; Supplier Part: C1554; Manufacturer: FH(风华); Supplier Footprint: 0402; JLCPCB Part Class: Basic Part; Datasheet: https://atta.szlcsc.com/upload/public/pdf/source/20200305/C486355_26A10D38EF8C2A5C37091D0039909270.pdf; Supplier: LCSC; Tolerance: ±5%
C12 C24 C38 C40 C41 = CL31A106KBHNNNE: Capacitance: Tolerance:±10% Tolerance:±10% Voltage Rated: Temperature Coefficient:; LCSC Part Name: 10uF ±10% 50V; Supplier Part: C13585; Manufacturer: SAMSUNG(三星); Supplier Footprint: 1206; JLCPCB Part Class: Basic Part; Datasheet: https://atta.szlcsc.com/upload/public/pdf/source/20160218/1457707763339.pdf; Supplier: LCSC; Tolerance: ±10%
CN1-CN3 CN5 CN6 = B3B-PH-K-S(LF)(SN): Reference Series:PH Pitch:2mm Pins Structure:1x3P Number of Rows:1 Number of PINs Per Row:3 Row Spacing:- Mounting Style:- Contact Material:Brass; LCSC Part Name: 系列:PH 间距:2mm 1x3P; Supplier Part: C131339; Manufacturer: JST; Supplier Footprint: 插件,P=2mm; JLCPCB Part Class: Extended Part; Datasheet: https://atta.szlcsc.com/upload/public/pdf/source/20171026/C131342_15089839687311058815.pdf; Supplier: LCSC; Reference Series: PH; Pitch: 2mm; Pins Structure: 1x3P; Number of Rows: 1; Number of PINs Per Row: 3; Contact Material: Brass
D1-D8 = 1N4004W_C18199087: Diode Configuration:Independent Voltage - Forward(Vf@If):1V@1.0A Voltage - DC Reverse(Vr):400V Current - Rectified:1A Reverse Leakage Current (Ir):2uA@400V Non-Repetitive Peak Forward Surge Current:30A Operating Junction Temperature Range:-55℃~+150℃ Opera; Supplier Part: C18199087; Manufacturer: R+O(宏嘉诚); Supplier Footprint: SOD-123FL; JLCPCB Part Class: Extended Part; Datasheet: https://item.szlcsc.com/datasheet/1N4004W/19354319.html; Supplier: LCSC; Diode Configuration: Independent; Forward Voltage (Vf@If): 1V@1.0A; Reverse Leakage Current: 2uA@400V; Voltage - Forward(Vf@If): 1V@1.0A; Voltage - DC Reverse(Vr): 400V; Current - Rectified: 1A; Reverse Leakage Current (Ir): 2uA@400V; Non-Repetitive Peak Forward Surge Current: 30A; Operating Junction Temperature Range: -55℃~+150℃
R1-R4 R17-R20 = FRC0402F1600TS: Type:Thick Film Resistor Resistance:160Ω Tolerance:±1% Tolerance:±1% Power(Watts):62.5mW Voltage-Supply(Max):50V Temperature Coefficient:±100ppm/℃ Temperature Coefficient:±100ppm/℃ Operating Temperature:-55℃~+155℃ Operating Temperature:-55℃~+155℃; LCSC Part Name: 160Ω ±1% 62.5mW 厚膜电阻; Supplier Part: C2933075; Manufacturer: FOJAN(富捷); Supplier Footprint: 0402; JLCPCB Part Class: Extended Part; Supplier: LCSC; Type: Thick Film Resistor; Tolerance: ±1%; Power(Watts): 62.5mW; Voltage-Supply(Max): 50V; Temperature Coefficient: ±100ppm/℃; Operating Temperature: -55℃~+155℃
R5 R6 R21 R22 = 0402WGF2201TCE: Type:Thick Film Resistors Resistance: Tolerance:±1% Tolerance:±1% Power(Watts): Temperature Coefficient:±100ppm/℃ Temperature Coefficient:±100ppm/℃ Overload Voltage (Max): Operating Temperature Range:-55℃~+155℃ Operating Temperature Range:-55℃~+155℃; LCSC Part Name: 厚膜电阻 2.2kΩ ±1% 62.5mW; Supplier Part: C25879; Manufacturer: UNI-ROYAL(厚声); Supplier Footprint: 0402; JLCPCB Part Class: Basic Part; Datasheet: https://atta.szlcsc.com/upload/public/pdf/source/20200306/C422600_1E6D84923E4A46A82E41ADD87F860B5C.pdf; Supplier: LCSC; Type: Thick Film Resistors; Tolerance: ±1%; Temperature Coefficient: ±100ppm/℃; Operating Temperature Range: -55℃~+155℃
R7 R13 R23 R29 R44 R46 R51 = RK09K1130AU2: Resistance: Tolerance:±20% Tolerance:±20% Power(Watts):50mW Turns:- Rated Voltage:20V; LCSC Part Name: 5kΩ ±20%; Supplier Part: C388855; Manufacturer: ALPSALPINE(阿尔卑斯阿尔派); Supplier Footprint: 插件; JLCPCB Part Class: Extended Part; Datasheet: https://atta.szlcsc.com/upload/public/pdf/source/20190429/C388855_623E995BFD4BB16C69F3599BAE69CE2C.pdf; Supplier: LCSC; Tolerance: ±20%; Power(Watts): 50mW; Rated Voltage: 20V
R8 R24 = 0402WGF3301TCE: Resistance:3300Ω Tolerance:±1% Tolerance:±1% Power(Watts): Overload Voltage (Max): Temperature Coefficient:±100ppm/℃ Temperature Coefficient:±100ppm/℃ Type:Thick Film Resistors Operating Temperature Range:-55℃~+155℃ Operating Temperature Range:-55℃~+155℃; LCSC Part Name: 3.3kΩ ±1% 62.5mW 厚膜电阻; Supplier Part: C25890; Manufacturer: UNI-ROYAL(厚声); Supplier Footprint: 0402; JLCPCB Part Class: Basic Part; Datasheet: https://atta.szlcsc.com/upload/public/pdf/source/20200306/C422600_1E6D84923E4A46A82E41ADD87F860B5C.pdf; Supplier: LCSC; Tolerance: ±1%; Temperature Coefficient: ±100ppm/℃; Type: Thick Film Resistors; Operating Temperature Range: -55℃~+155℃
R9 R25 = 0402WGF1502TCE: Resistance:15000Ω Tolerance:±1% Tolerance:±1% Power(Watts): Overload Voltage (Max): Temperature Coefficient:±100ppm/℃ Temperature Coefficient:±100ppm/℃ Type:Thick Film Resistors Operating Temperature Range:-55℃~+155℃ Operating Temperature Range:-55℃~+155℃; LCSC Part Name: 15kΩ ±1% 62.5mW 厚膜电阻; Supplier Part: C25756; Manufacturer: UNI-ROYAL(厚声); Supplier Footprint: 0402; JLCPCB Part Class: Basic Part; Datasheet: https://atta.szlcsc.com/upload/public/pdf/source/20200306/C422600_1E6D84923E4A46A82E41ADD87F860B5C.pdf; Supplier: LCSC; Tolerance: ±1%; Temperature Coefficient: ±100ppm/℃; Type: Thick Film Resistors; Operating Temperature Range: -55℃~+155℃
R11 R16 R27 R32 = 0402WGF2202TCE: Type:Thick Film Resistors Resistance: Tolerance:±1% Tolerance:±1% Power(Watts): Temperature Coefficient:±100ppm/℃ Temperature Coefficient:±100ppm/℃ Overload Voltage (Max): Operating Temperature Range:-55℃~+155℃ Operating Temperature Range:-55℃~+155℃; LCSC Part Name: 厚膜电阻 22kΩ ±1% 62.5mW; Supplier Part: C25768; Manufacturer: UNI-ROYAL(厚声); Supplier Footprint: 0402; JLCPCB Part Class: Basic Part; Datasheet: https://atta.szlcsc.com/upload/public/pdf/source/20200306/C422600_1E6D84923E4A46A82E41ADD87F860B5C.pdf; Supplier: LCSC; Type: Thick Film Resistors; Tolerance: ±1%; Temperature Coefficient: ±100ppm/℃; Operating Temperature Range: -55℃~+155℃
R14 R15 R30 R31 = 0402WGF5101TCE: Resistance:5100Ω Tolerance:±1% Tolerance:±1% Power(Watts): Overload Voltage (Max): Temperature Coefficient:±100ppm/℃ Temperature Coefficient:±100ppm/℃ Type:Thick Film Resistors Operating Temperature Range:-55℃~+155℃ Operating Temperature Range:-55℃~+155℃; LCSC Part Name: 5.1kΩ ±1% 62.5mW 厚膜电阻; Supplier Part: C25905; Manufacturer: UNI-ROYAL(厚声); Supplier Footprint: 0402; JLCPCB Part Class: Basic Part; Datasheet: https://atta.szlcsc.com/upload/public/pdf/source/20200306/C422600_1E6D84923E4A46A82E41ADD87F860B5C.pdf; Supplier: LCSC; Tolerance: ±1%; Temperature Coefficient: ±100ppm/℃; Type: Thick Film Resistors; Operating Temperature Range: -55℃~+155℃
R78-R85 = 0805W8F0000T5E_C17477: Type:Thick Film Resistors Resistance: Tolerance:±1% Tolerance:±1% Power(Watts): Overload Voltage (Max): Temperature Coefficient:±800ppm/℃ Temperature Coefficient:±800ppm/℃ Operating Temperature Range:-55℃~+155℃ Operating Temperature Range:-55℃~+155℃; LCSC Part Name: 0Ω ±1% 125mW 厚膜电阻; Supplier Part: C17477; Manufacturer: UNI-ROYAL(厚声); Manufacturer Part: 0805W8F0000T5E; Supplier Footprint: 0805; JLCPCB Part Class: Basic Part; Datasheet: https://atta.szlcsc.com/upload/public/pdf/source/20200306/C422600_1E6D84923E4A46A82E41ADD87F860B5C.pdf; Supplier: LCSC; Type: Thick Film Resistors; Tolerance: ±1%; Temperature Coefficient: ±800ppm/℃; Operating Temperature Range: -55℃~+155℃
R97 R98 = 0402WGF1003TCE: Type:Thick Film Resistors Resistance: Tolerance:±1% Tolerance:±1% Power(Watts): Temperature Coefficient:±100ppm/℃ Temperature Coefficient:±100ppm/℃ Overload Voltage (Max): Operating Temperature Range:-55℃~+155℃ Operating Temperature Range:-55℃~+155℃; LCSC Part Name: 100kΩ ±1% 62.5mW; Supplier Part: C25741; Manufacturer: UNI-ROYAL(厚声); Supplier Footprint: 0402; JLCPCB Part Class: Basic Part; Datasheet: https://atta.szlcsc.com/upload/public/pdf/source/20200306/C422600_1E6D84923E4A46A82E41ADD87F860B5C.pdf; Supplier: LCSC; Type: Thick Film Resistors; Tolerance: ±1%; Temperature Coefficient: ±100ppm/℃; Operating Temperature Range: -55℃~+155℃
U1 U3 = TLV6741DCKR: Number of Circuits: -3db Bandwidth:- Current - Input Bias(Ib):10pA Gain Bandwidth Product(GBP):10MHz Slew Rate(SR):4.75V/us Output Current:- Operating Temperature:-40℃~+125℃ Operating Temperature:-40℃~+125℃; Supplier Part: C2760465; Manufacturer: TI(德州仪器); Supplier Footprint: SC-70-5; JLCPCB Part Class: Extended Part; Datasheet: https://atta.szlcsc.com/upload/public/pdf/source/20230221/5EB498305BD887DA7976F3B40C05B71F.pdf; Supplier: LCSC; Current - Input Bias(Ib): 10pA; Gain Bandwidth Product(GBP): 10MHz; Slew Rate(SR): 4.75V/us; Operating Temperature: -40℃~+125℃
U2 = MCP6002-I/SN: Number of Circuits:; Supplier Part: C116706; Manufacturer: MICROCHIP(美国微芯); Supplier Footprint: SOIC-8; JLCPCB Part Class: Extended Part; Datasheet: https://atta.szlcsc.com/upload/public/pdf/source/20170912/C116706_1505207847350963520.pdf; Supplier: LCSC; Current - Input Bias(Ib): 1pA; Gain Bandwidth Product(GBP): 1MHz; Slew Rate(SR): 0.6V/us; Output Current: 23mA; Supply Voltage: 1.8V~6V; Supply Current: 100uA; Operating Temperature: -40℃~+85℃
U4 U5 U9 U10 = MCP6002-I/SN: Number of Circuits:; Supplier Part: C116706; Manufacturer: MICROCHIP(美国微芯); Supplier Footprint: SOIC-8; JLCPCB Part Class: Extended Part; Datasheet: https://atta.szlcsc.com/upload/public/pdf/source/20170912/C116706_1505207847350963520.pdf; Supplier: LCSC
C25 = 0402CG470J500NT: Capacitance: Tolerance:±5% Tolerance:±5% Voltage Rated: Temperature Coefficient:; LCSC Part Name: 47pF ±5% 50V; Supplier Part: C1567; Manufacturer: FH(风华); Supplier Footprint: 0402; JLCPCB Part Class: Basic Part; Datasheet: https://atta.szlcsc.com/upload/public/pdf/source/20200305/C486355_26A10D38EF8C2A5C37091D0039909270.pdf; Supplier: LCSC; Tolerance: ±5%
C27 C29 = CL05A105KA5NQNC: Capacitance: Tolerance:±10% Tolerance:±10% Voltage Rated: Temperature Coefficient:; LCSC Part Name: 1uF ±10% 25V; Supplier Part: C52923; Manufacturer: SAMSUNG(三星); Supplier Footprint: 0402; JLCPCB Part Class: Basic Part; Datasheet: https://atta.szlcsc.com/upload/public/pdf/source/20160103/1457707735223.pdf; Supplier: LCSC; Tolerance: ±10%; Check: true
C32 C43 C44 C58 = TAJA106K016RNJ: Capacitance: Tolerance:±10% Tolerance:±10% Rated Voltage: Equivalent Series Resistance(ESR):3Ω@100kHz Operating Temperature:-55℃~+125℃ Operating Temperature:-55℃~+125℃; LCSC Part Name: 10uF ±10% 16V; Supplier Part: C7171; Manufacturer: Kyocera AVX; Supplier Footprint: CASE-A-3216; JLCPCB Part Class: Basic Part; Datasheet: https://atta.szlcsc.com/upload/public/pdf/source/20160107/1457707748093.pdf; Supplier: LCSC; Tolerance: ±10%; Equivalent Series Resistance(ESR): 3Ω@100kHz; Operating Temperature: -55℃~+125℃
C33 C35 = CL10B473KB8NNNC: Capacitance: Tolerance:±10% Tolerance:±10% Voltage Rated: Temperature Coefficient:; LCSC Part Name: 47nF ±10% 50V; Supplier Part: C1622; Manufacturer: SAMSUNG(三星); Supplier Footprint: 0603; JLCPCB Part Class: Basic Part; Datasheet: https://atta.szlcsc.com/upload/public/pdf/source/20160218/1457707763339.pdf; Supplier: LCSC; Tolerance: ±10%
C34 = CC0402JRX7R9BB561: Capacitance: Tolerance:±5% Tolerance:±5% Voltage Rated: Temperature Coefficient:; LCSC Part Name: 560pF ±5% 50V; Supplier Part: C541456; Manufacturer: YAGEO(国巨); Supplier Footprint: 0402; JLCPCB Part Class: Extended Part; Datasheet: https://atta.szlcsc.com/upload/public/pdf/source/20200615/C541456_85730C2B8D04740A1E656F7AF7FC699B.pdf; Supplier: LCSC; Tolerance: ±5%
R37 R40 R45 R48 R57-R59 R87 = 0402WGF2202TCE: Type:Thick Film Resistors Resistance: Tolerance:±1% Tolerance:±1% Power(Watts): Temperature Coefficient:±100ppm/℃ Temperature Coefficient:±100ppm/℃ Overload Voltage (Max): Operating Temperature Range:-55℃~+155℃ Operating Temperature Range:-55℃~+155℃; LCSC Part Name: 厚膜电阻 22kΩ ±1% 62.5mW; Supplier Part: C25768; Manufacturer: UNI-ROYAL(厚声); Supplier Footprint: 0402; JLCPCB Part Class: Basic Part; Datasheet: https://atta.szlcsc.com/upload/public/pdf/source/20200306/C422600_1E6D84923E4A46A82E41ADD87F860B5C.pdf; Supplier: LCSC; Type: Thick Film Resistors; Tolerance: ±1%; Temperature Coefficient: ±100ppm/℃; Operating Temperature Range: -55℃~+155℃; Check: true
R42 R47 R60 R61 R65-R68 = 0402WGF1002TCE: Type:Thick Film Resistors Resistance: Tolerance:±1% Tolerance:±1% Power(Watts): Temperature Coefficient:±100ppm/℃ Temperature Coefficient:±100ppm/℃ Overload Voltage (Max): Operating Temperature Range:-55℃~+155℃ Operating Temperature Range:-55℃~+155℃; LCSC Part Name: 厚膜电阻 10kΩ ±1% 62.5mW; Supplier Part: C25744; Manufacturer: UNI-ROYAL(厚声); Supplier Footprint: 0402; JLCPCB Part Class: Basic Part; Datasheet: https://atta.szlcsc.com/upload/public/pdf/source/20200306/C422600_1E6D84923E4A46A82E41ADD87F860B5C.pdf; Supplier: LCSC; Type: Thick Film Resistors; Tolerance: ±1%; Temperature Coefficient: ±100ppm/℃; Operating Temperature Range: -55℃~+155℃; Check: true
R49 = 0402WGF1004TCE: Type:Thick Film Resistor Resistance:1MΩ Tolerance:±1% Tolerance:±1% Power(Watts):62.5mW Voltage-Supply(Max):50V Temperature Coefficient:±100ppm/℃ Temperature Coefficient:±100ppm/℃ Operating Temperature:-55℃~+155℃ Operating Temperature:-55℃~+155℃; LCSC Part Name: 1MΩ ±1% 62.5mW 厚膜电阻; Supplier Part: C26083; Manufacturer: UNI-ROYAL(厚声); Supplier Footprint: 0402; JLCPCB Part Class: Basic Part; Datasheet: https://item.szlcsc.com/datasheet/0402WGF1004TCE/26826.html; Supplier: LCSC; Type: Thick Film Resistor; Tolerance: ±1%; Power(Watts): 62.5mW; Voltage-Supply(Max): 50V; Temperature Coefficient: ±100ppm/℃; Operating Temperature: -55℃~+155℃
R52 = 0402WGF1502TCE: Type:Thick Film Resistors Resistance:15kΩ Tolerance:±1% Tolerance:±1% Power(Watts): Overload Voltage (Max): Temperature Coefficient:±100ppm/℃ Temperature Coefficient:±100ppm/℃ Operating Temperature Range:-55℃~+155℃ Operating Temperature Range:-55℃~+155℃; LCSC Part Name: 15kΩ ±1% 62.5mW 厚膜电阻; Supplier Part: C25756; Manufacturer: UNI-ROYAL(厚声); Supplier Footprint: 0402; JLCPCB Part Class: Basic Part; Datasheet: https://atta.szlcsc.com/upload/public/pdf/source/20200306/C422600_1E6D84923E4A46A82E41ADD87F860B5C.pdf; Supplier: LCSC; Tolerance: ±1%; Temperature Coefficient: ±100ppm/℃; Type: Thick Film Resistors; Operating Temperature Range: -55℃~+155℃
U6 = LM1971MX/NOPB: Supply Voltage:4.5V~12V Supply Voltage:4.5V~12V; Supplier Part: C129348; Manufacturer: TI(德州仪器); Supplier Footprint: SOIC-8; JLCPCB Part Class: Extended Part; Datasheet: https://www.ti.com/cn/lit/gpn/lm1971; Supplier: LCSC; Supply Voltage: 4.5V~12V
U7 = MCP6001T-I/OT: Number of Circuits:; Supplier Part: C116490; Manufacturer: MICROCHIP(美国微芯); Supplier Footprint: SOT-23-5; JLCPCB Part Class: Extended Part; Datasheet: https://atta.szlcsc.com/upload/public/pdf/source/20170925/C116490_1506321357429990114.pdf; Supplier: LCSC
R53 R54 R86 = 0805W8F1102T5E: Type:Thick Film Resistors Resistance:11kΩ Tolerance:±1% Tolerance:±1% Power(Watts): Overload Voltage (Max): Temperature Coefficient:±100ppm/℃ Temperature Coefficient:±100ppm/℃ Operating Temperature Range:-55℃~+155℃ Operating Temperature Range:-55℃~+155℃; LCSC Part Name: 11kΩ ±1% 125mW 厚膜电阻; Supplier Part: C17429; Manufacturer: UNI-ROYAL(厚声); Supplier Footprint: 0805; JLCPCB Part Class: Extended Part; Datasheet: https://atta.szlcsc.com/upload/public/pdf/source/20200306/C422600_1E6D84923E4A46A82E41ADD87F860B5C.pdf; Supplier: LCSC; Type: Thick Film Resistors; Tolerance: ±1%; Temperature Coefficient: ±100ppm/℃; Operating Temperature Range: -55℃~+155℃; Check: true
R64 = 0805W8F4702T5E: Type:Thick Film Resistors Resistance:47kΩ Tolerance:±1% Tolerance:±1% Power(Watts): Overload Voltage (Max): Temperature Coefficient:±100ppm/℃ Temperature Coefficient:±100ppm/℃ Operating Temperature Range:-55℃~+155℃ Operating Temperature Range:-55℃~+155℃; LCSC Part Name: 47kΩ ±1% 125mW 厚膜电阻; Supplier Part: C17713; Manufacturer: UNI-ROYAL(厚声); Supplier Footprint: 0805; JLCPCB Part Class: Basic Part; Datasheet: https://atta.szlcsc.com/upload/public/pdf/source/20200306/C422600_1E6D84923E4A46A82E41ADD87F860B5C.pdf; Supplier: LCSC; Type: Thick Film Resistors; Tolerance: ±1%; Temperature Coefficient: ±100ppm/℃; Operating Temperature Range: -55℃~+155℃; Check: true
C45 = CA45-B-25V-10uF-K: Capacitance: Tolerance:±10% Tolerance:±10% Rated Voltage: Equivalent Series Resistance(ESR):6Ω@100kHz Operating Temperature:-55℃~+125℃ Operating Temperature:-55℃~+125℃; LCSC Part Name: 10uF ±10% 25V; Supplier Part: C128259; Manufacturer: CEC(振华新云); Supplier Footprint: CASE-B-3528; JLCPCB Part Class: Extended Part; Datasheet: https://atta.szlcsc.com/upload/public/pdf/source/20170914/C128259_1505359753672967907.pdf; Supplier: LCSC; Tolerance: ±10%; Equivalent Series Resistance(ESR): 6Ω@100kHz; Operating Temperature: -55℃~+125℃
C46 = CL05B104KB54PNC: Capacitance: Tolerance:±10% Tolerance:±10% Voltage Rated: Temperature Coefficient:; LCSC Part Name: 100nF ±10% 50V; Supplier Part: C307331; Manufacturer: SAMSUNG(三星); Supplier Footprint: 0402; JLCPCB Part Class: Basic Part; Datasheet: https://atta.szlcsc.com/upload/public/pdf/source/20160218/1457707763339.pdf; Supplier: LCSC; Tolerance: ±10%; Check: true
CN13 = B2B-XH-A(LF)(SN): Pins Structure:1x2P Pitch:2.5mm Mounting Type:Through Hole Reference Series:XH Number of Pins:2P Number of Rows:1 Number of PINs Per Row:2 Row Spacing:- Current Rating:3A Contact Material:Brass Contact Plating:Tin Operating Temperature:-25℃~+85℃ Operating; LCSC Part Name: 1x2P 间距:2.5mm 直插 系列:XH; Supplier Part: C158012; Manufacturer: JST; Supplier Footprint: 插件,P=2.5mm; JLCPCB Part Class: Extended Part; Datasheet: https://item.szlcsc.com/datasheet/B2B-XH-A(LF)(SN)/169360.html; Supplier: LCSC; Pins Structure: 1x2P; Pitch: 2.5mm; Mounting Type: Through Hole; Reference Series: XH; Number of Pins: 2P; Number of Rows: 1; Number of PINs Per Row: 2; Current Rating: 3A; Contact Material: Brass; Contact Plating: Tin; Operating Temperature: -25℃~+85℃; Voltage Rating: 250V; Plastic Material: PA66; Flame Retardant Rating: UL94V-0; Supplementary Features: K Pin; Color: White; Z-Height of the Board: 7mm; X-Length of Bottom Edge on Board (Spacing Line): 7.4mm; Y-Width of Bottom Edge on Board: 5.75mm
U8 = HT7550-1_C347189: Output Type: Maximum Input Voltage:30V Output Voltage:5V Output Voltage:5V Output Current:100mA Power Supply Rejection Ratio (PSRR):- Dropout Voltage:100mV@(1mA) Quiescent Current (Ground Current):3uA Operating Temperature:-25℃~+70℃ Operating Temperature:; LCSC Part Name: 输入30V 输出5V 100mA; Supplier Part: C347189; Manufacturer: UMW(友台半导体); Supplier Footprint: SOT-89; JLCPCB Part Class: Extended Part; Datasheet: https://atta.szlcsc.com/upload/public/pdf/source/20231109/E587E38465720CDF1B9E4B203F8DC229.pdf; Supplier: LCSC; Maximum Input Voltage: 30V; Output Voltage: 5V; Output Current: 100mA; Dropout Voltage: 100mV@(1mA); Quiescent Current (Ground Current): 3uA; Operating Temperature: -25℃~+70℃; Output Polarity: Positive; Number of Outputs: 1

## Nets
+5V: C6.2 C8.2 C18.2 C20.2 C30.1 C31.1 C32.1 C36.2 C39.2 C42.1 C47.1 C48.2 C52.2 C53.1 CN14.2 CN15.4 D1.1(K) D2.1(K) D5.1(K) D6.1(K) R71.1 R74.2 R100.2 R102.2 R103.2 U1.5(V+) U2.8(VDD) U3.5(V+) U4.8(VDD) U5.8(VDD) U6.7(VDD) U7.5(VDD) U8.3(VOUT) U9.8(VDD) U10.8(VDD) U12.5(Vcc/AVCC/ADC_VRef+) U13.2
GND: C6.1 C8.1 C18.1 C20.1 C25.1 C30.2 C31.2 C32.2 C36.1 C39.1 C42.2 C45.2 C46.1 C47.2 C48.1 C49.2 C50.1 C51.1 C52.1 C53.2 C58.2 C61.1 C62.1 C63.1 CN1.2 CN2.2 CN3.1 CN5.3 CN6.1 CN13.2 CN14.1 CN14.5 CN14.6 CN15.5 CN15.6 CN15.7 D3.2(A) D4.2(A) D7.2(A) D8.2(A) H6.1 R7.4 R7.5 R13.4 R13.5 R23.4 R23.5 R29.4 R29.5 R44.4 R44.5 R46.4 R46.5 R51.4 R51.5 R60.2 R61.1 R67.1 R68.2 R72.2 R76.1 R93.1 R94.1 R95.1 R96.1 SW1.2 SW1.3 SW1.4 SW2.2 SW2.3 SW2.4 U1.2(V-) U2.4(VSS) U3.2(V-) U4.4(VSS) U5.4(VSS) U6.3(GND) U7.2(VSS) U8.1(GND) U9.4(VSS) U10.4(VSS) U12.7(Gnd/AGnd)
Vbatt: C45.1 C46.2 CN13.1 R75.1 U8.2(VIN)
BATMON: C62.2 C63.2 R75.2 R76.2 U12.16(CCP1/RXD2/ADC0/P1.0)
MICOUT1: C12.2 R53.1
MICOUT2: C24.2 R54.1
MUSICOUT: CN5.2 R62.2
MUSICOUT1: C38.2 R56.1 U9.5(VINB+)
OUTMON: C43.1 C55.2 R64.2 R65.2 U10.1(VOUTA) U12.17(12CSDA/MISO/ADC4/P1.4)
RST/P5.4: R100.1 R101.1 U12.4(MCLKO/RST/P5.4)
RXD/P3.0: D9.2(A) U12.8(P3.0/ADC8/RXD/INT4)
SCL: CN14.4 R102.1 U12.20(CCP0/TXD2/ADC1/P1.1)
SDA: CN14.3 R103.1 U12.19(T2/ECI/SS/ADC2/P1.2)
SWITCH1: SW1.1 U12.1(SCLK/ADC5/P1.5)
SWITCH2: SW2.1 U12.2(XTALO/ADC6/P1.6)
TP1: H6.2 U12.18(T2CLKO/MOSI/ADC3/P1.3)
TXD/P3.1: R99.1 U12.9(P3.1/ADC9/TXD)
Vgnd: C4.2 C16.2 C49.1 C50.2 R5.2 R7.1 R8.2 R9.1 R12.2 R21.2 R23.1 R24.2 R25.1 R28.2 R39.2 R41.1 R43.1 R50.2 R51.1 R52.1 R55.1 R56.2 R71.2 R72.1 R77.1 R86.1
VOICEOUT: CN5.1 R63.2
VOL_ADC1: C51.2 C61.2 CN3.3 R74.1 R104.2
VOL_CLK: U6.6(CLOCK) U12.10(P3.2/ADC10/INTO)
VOL_DATA: U6.5(DATA) U12.11(P3.3/ADC11/INT1)
VOL_LOAD: U6.4(LOAD) U12.12(P3.4/ADC12/T0)
$1N20667: C9.2 R14.1
$1N20668: C10.2 R15.1
$1N20669: R13.3 R15.2 R16.1
$1N20670: C9.1 R11.2 R97.2
$1N25442: C1.2 R1.1
$1N25481: C2.2 R2.1
$1N25706: C3.1 R1.2 R3.1
$1N25711: C3.2 R2.2 R4.1
$1N26543: R12.1 U2.5(VINB+)
$1N28301: C5.1 D1.2(A) D3.1(K) R3.2 R6.1 U1.3(IN-)
$1N28981: C11.1 R13.2 U2.6(VINB-)
$1N29047: C7.1 R8.1 R10.1 U2.2(VINA-)
$1N29316: C1.1 CN1.3 R95.2
$1N29420: C4.1 D2.2(A) D4.1(K) R4.2 R5.1 U1.1(IN+)
$1N30744: C12.1 R79.2
$1N35236: C10.1 R11.1 R78.2
$1N35251: C7.2 R10.2 R78.1 U2.1(VOUTA)
$1N35514: C11.2 R7.3 R14.2 R16.2 U2.7(VOUTB)
$1N35542: R7.2 R9.2 R79.1
$1N35580: C5.2 R6.2 U1.4(OUT) U2.3(VINA+)
$1N37557: C2.1 CN1.1 R96.2
$1N42831: R13.1 R97.1
$2N20964: C21.2 R30.1
$2N20966: C22.2 R31.1
$2N20968: R29.3 R31.2 R32.1
$2N20969: C21.1 R27.2 R98.2
$2N20975: C13.2 R17.1
$2N20977: C14.2 R18.1
$2N20979: C15.1 R17.2 R19.1
$2N20982: C15.2 R18.2 R20.1
$2N20986: R28.1 U4.5(VINB+)
$2N20988: C17.1 D5.2(A) D7.1(K) R19.2 R22.1 U3.3(IN-)
$2N21045: C23.1 R29.2 U4.6(VINB-)
$2N21050: C19.1 R24.1 R26.1 U4.2(VINA-)
$2N21072: C13.1 CN2.3 R93.2
$2N21083: C16.1 D6.2(A) D8.1(K) R20.2 R21.1 U3.1(IN+)
$2N22314: C24.1 R80.2
$2N22318: C23.2 R23.3 R30.2 R32.2 U4.7(VOUTB)
$2N22360: C22.1 R27.1 R81.2
$2N25778: R23.2 R25.2 R80.1
$2N25871: C17.2 R22.2 U3.4(OUT) U4.3(VINA+)
$2N25928: C19.2 R26.2 R81.1 U4.1(VOUTA)
$2N27932: C14.1 CN2.1 R94.2
$2N32117: R29.1 R98.1
$6N485: C27.2 R37.1
$6N8330: R37.2 R39.1 U5.3(VINA+)
$6N8938: C25.2 C27.1 R34.1
$6N11279: C34.1 R46.2
$6N11282: R42.2 R46.3
$6N11283: R46.1 R47.1
$6N11290: C34.2 C37.1 R45.1 R49.1 U5.6(VINB-)
$6N13703: CN3.2 R34.2
$6N16037: C33.2 R40.2 R44.3
$6N16040: C33.1 C35.1 R44.2 R45.2
$6N16049: C35.2 R44.1 R48.1
$6N19592: R50.1 U5.5(VINB+)
$6N21767: R51.3 U7.1(VOUT) U7.4(VIN-)
$6N22965: R40.1 R42.1 R82.2
$6N23115: C38.1 R84.2
$6N26920: R82.1 U5.1(VOUTA) U5.2(VINA-)
$6N26939: C37.2 R47.2 R48.2 R49.2 R83.1 U5.7(VOUTB)
$6N26968: R51.2 R52.2 R84.1
$6N31799: C29.1 R83.2
$6N32061: C58.1 R41.2 U6.1(VREFIN)
$6N32096: C29.2 H5.2 U6.8(IN)
$6N32112: H5.1 R43.2 U6.2(OUT) U7.3(VIN+)
$8N548: C43.2 R67.2 R69.1
$8N551: C44.2 R68.1 R70.1
$8N1825: C40.2 R60.1 R63.1
$8N2251: C41.2 R61.2 R62.1
$8N6158: CN6.3 R69.2
$8N9357: R58.2 R59.2 R85.2
$8N10186: R55.2 U10.3(VINA+) U10.5(VINB+)
$8N10241: R77.2 U9.3(VINA+)
$8N11190: C56.2 R65.1 R66.2 U10.6(VINB-)
$8N11211: C44.1 C56.1 R66.1 U10.7(VOUTB)
$8N11256: C54.1 R53.2 R54.2 R57.1 U9.2(VINA-)
$8N11268: C40.1 C54.2 R57.2 R58.1 U9.1(VOUTA)
$8N12340: C55.1 R64.1 R85.1 U10.2(VINA-)
$8N12517: C57.1 R86.2 R87.1 U9.6(VINB-)
$8N12572: C41.1 C57.2 R59.1 R87.2 U9.7(VOUTB)
$8N14533: CN6.2 R70.2
$9N10742: R73.1 U13.4
$9N10748: R91.1 U13.3
$9N10755: R92.1 U13.1
$9N12859: R91.2 U12.14(P3.6/ADC14/INT2)
$9N13226: R92.2 U12.15(P3.7/INT3/TXD_2)
$9N13231: R73.2 U12.13(P3.5/ADC13/T1)
$9N16093: CN15.1 R101.2
$9N16100: CN15.2 D9.1(K)
$9N16109: CN15.3 R99.2
$9N18983: R104.1 U12.3(XTALI/ADC7/P1.7)

Not connected (* = marked no-connect by the designer): U12 6(P5.5)* 21(EP)*

## Notes on the sheets
sheet 1
- MIXER V3.0
- Microphone preamp, Mic #1
- TODO:
  - add 100K to TONE pot to bias it
  - upside down all the pots so they can be assembled by JLCPCB
- Balanced
  Input Buffer (+17dB)
- MIC VOLUME Ctrl
  Secondary buffer (+17dB)
- Single "Tilt" (+/-16dB) with pre-tilt
  TONE Control (+0dB)
- 47K resistors take inputs
  to ground when
  no mic is plugged in
- Matched R
  to 1%
- JST-PH
  to XLR
  Combo
- BASS      TREBLE
- TP 2
- TP 1
- HIGH
- LOW
- NOTE:
     MIC1 channel is using TLV6741 (3.5nV/sqrt(Hz))
  For comparison:
     LMV721  is 8.5nV/sqrt(Hz)
     MCP6002 is 28nV/sqrt(Hz)
  On XLR connector:
  pin 1: ground/shield
  pin 2: positive/hot
  pin 3: negative/cold
  On XLR connector board:
  pin 1: cold/ring_sleeve/RS (shorted to ground when Hilton plugged in)
  pin 2: common ground
  pin 3: hot/tip/T
sheet 2
- MIXER V3.0
- Microphone preamp, Mic #2
- Single "Tilt" (+/-16dB) with pre-tilt
  TONE Control (+0dB)
- Balanced
  Input Buffer (+17dB)
- MIC VOLUME Ctrl
  Secondary buffer (+17dB)
- 47K resistors take inputs
  to ground when
  no mic is plugged in
- Matched R
  to 1%
- JST-PH
  to XLR
  Combo
- BASS     TREBLE
- TP 3
- TP 4
- 1
- HIGH
- LOW
- NOTE:
     MIC2 channel is using TLV6741 (3.5nV/sqrt(Hz))
  For comparison:
     LMV721  is 8.5nV/sqrt(Hz)
     MCP6002 is 28nV/sqrt(Hz)
sheet 3
- MIXER V3.0
- Input Power Management
- 9V_IN
- (For battery monitoring)
- SWITCHED
  MAIN POWER
  IN (JST-XH)
- (Virtual Ground = 2.5V)
sheet 4
- MIXER V3.0
- Music Mixer/Preamp/Remote Vol/Main Vol Control
- (source: https://www.ti.com/lit/ug/tidu034/tidu034.pdf, https://sound-au.com/project01.htm,
  http://www.guitarscience.net/tsc/baxandall_1.htm)
- AUX Mixer/
  Input buffer
- Bass/Treble
  Control
- BASS
- MUSIC/
  RVC IN
- RF Filter
- lift    cut
- TP 6
- TP 5
- lift    cut
- TREBLE
- RVOL bypass
- 1
- TP 7
sheet 5
- MIXER V3.0
- Final Mixer/Balanced output driver
- Unbalanced
  2-channel output
- Voice Mixer &
  Voice Out Buffer (+6dB)
- Voice/Music Mixer
- XLR Balanced
  Mono Output
- TP 8
- GND
- HOT
- COLD
- Balanced
  output driver
- Music Out Buffer (+6dB)
sheet 6
- MIXER V3.0
- MCU (Battery Monitor, Remote Vol Ctrl)
- STEMMA QT (vertical)
  - pin 1: black/GND
  - pin 2: red/+5V
  - pin 3: blue/SDA
  - pin 4: yellow/SCL
- Mechanical LED footprint is 0.1" centers
  (like this connector). Long lead is pin 2, which
  should be marked with a dot.
  LED: VU Meter (R = clipping) & Battery Monitor (G/Y/R)
- Battery
  Monitor
- 100nF and 1nF
  caps must be
  close to the ADC.
- R
- G
- B
- Two SPST
  N.O. right-angle
  buttons (w/4.1K MCU pullups)
  for RVC curve select
  and LED mode.
- RVOL (20K pot,
  0R = full vol)
- STC8 ISP interface
  JST-SH 5-pin right-angle
  (Vcc/DTR/TxD/RxD/GND)
- 100nF and 1nF
  caps must be
  close to the ADC.
- NOTE: Make sure that power from
  9V battery and 12V P/S are OFF
  before using ISP. Mixer power
  switch OFF will ensure this.
  NOTE: Use C91552 for just 4 2.5mm right-angle pins.
  JST-SH PINOUT:
  1 - DTR active low
  2 - TX
  3 - RX
  4 - Vcc
  5 - GND
- NOTE: Digital section must be carefully isolated from Analog section.
  NOTE: VOL_ADC{1,2} are +5 when there is no
  Remote Vol Ctrl plugged in.  They are 0 - 2.5V
  when the RVC{1,2} is plugged in.
  NOTE: BATT_MON is 0 - 2.7V for +9V input.
  RVOL in  LB-202 goes to a STEREO TRS connector:
      If (Normal RVC mode) then
          // S shorted to R
          VOL = T;
  Y adapter for both use cases:
      https://www.amazon.com/gp/product/B096XNHTH3?th=1
  Dongle for MUTE functionality:
      https://www.amazon.com/gp/product/B01G0NFET2
  STEMMA QT connector is for +5V and +5V-compatible devices only.
